# EAGLE design UFBmod_1V0 (EAGLE 7.7.0)
UFBmod - the best digital modulation ever created :-)
Assembly variants: Max, Std

## Sheet 1 of 8: Digilent FPGA
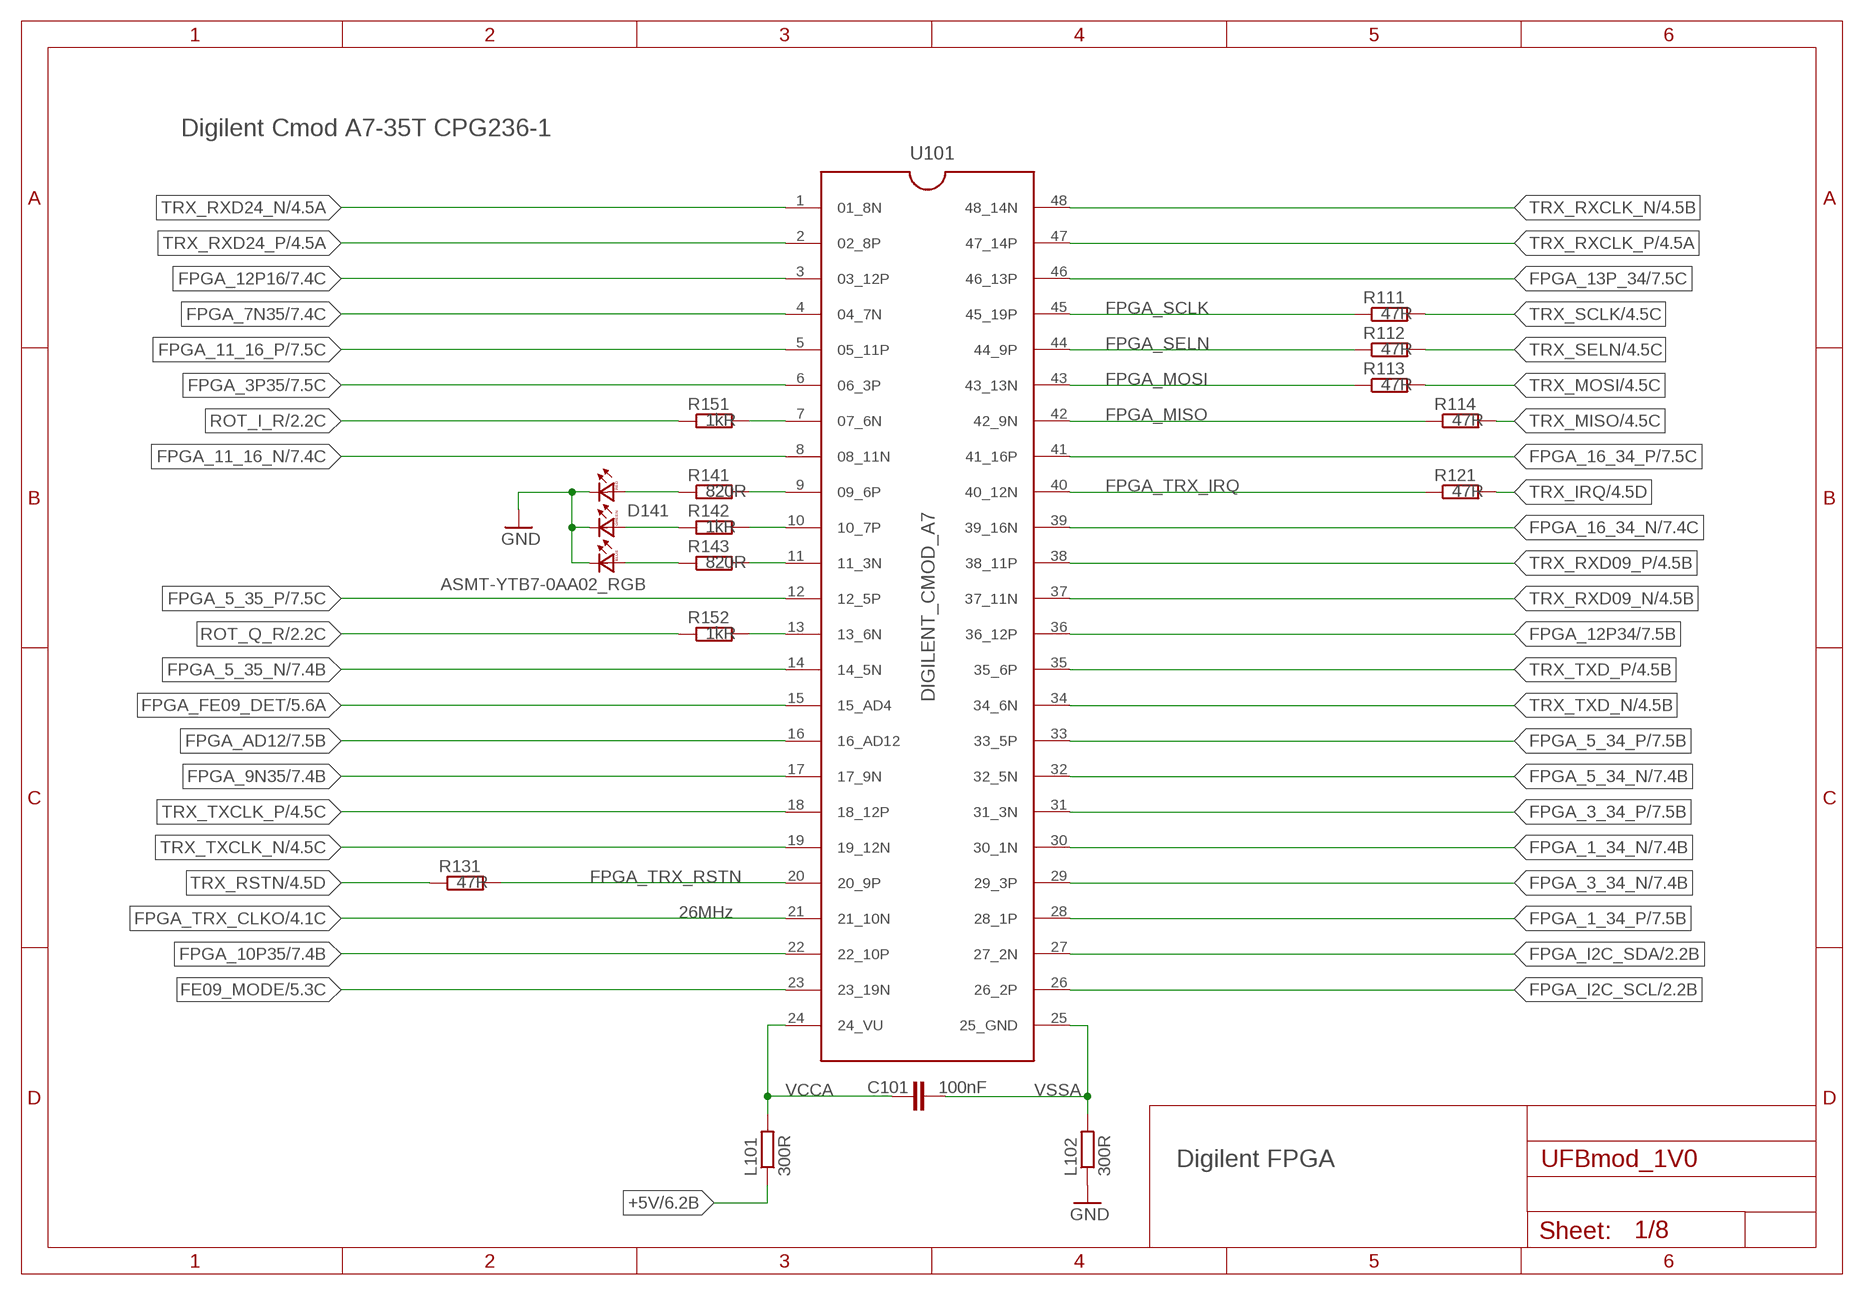
[diagram p0: schematic, sheet 1]

### Parts
C101  100nF  C-EUC0402  [C0402]
D141  ASMT-YTB7-0AA02_RGB  [ASMT-YTB7_0AA02_RGB]
L101  300R  R-EU_R1206  [R1206]
L102  300R  R-EU_R1206  [R1206]
R111  47R  R-EU_R0402  [R0402]
R112  47R  R-EU_R0402  [R0402]
R113  47R  R-EU_R0402  [R0402]
R114  47R  R-EU_R0402  [R0402]
R121  47R  R-EU_R0402  [R0402]
R131  47R  R-EU_R0402  [R0402]
R141  820R  R-EU_R0402  [R0402]
R142  1kR  R-EU_R0402  [R0402]
R143  820R  R-EU_R0402  [R0402]
R151  1kR  R-EU_R0402  [R0402]
R152  1kR  R-EU_R0402  [R0402]
U101  DIGILENT_CMOD_A7  [DIGILENT_CMOD_A7__DIP48]

### Nets
+5V: L101.1 ; also sheet 6,7
FE09_MODE: U101.23(23_19N) ; also sheet 5
FPGA_1_34_N: U101.30(30_1N) ; also sheet 7
FPGA_1_34_P: U101.28(28_1P) ; also sheet 7
FPGA_3_34_N [diff_100R]: U101.29(29_3P) ; also sheet 7
FPGA_3_34_P [diff_100R]: U101.31(31_3N) ; also sheet 7
FPGA_3P35 [diff_100R]: U101.6(06_3P) ; also sheet 7
FPGA_5_34_N [diff_100R]: U101.32(32_5N) ; also sheet 7
FPGA_5_34_P [diff_100R]: U101.33(33_5P) ; also sheet 7
FPGA_5_35_N [diff_100R]: U101.14(14_5N) ; also sheet 7
FPGA_5_35_P [diff_100R]: U101.12(12_5P) ; also sheet 7
FPGA_7N35 [diff_100R]: U101.4(04_7N) ; also sheet 7
FPGA_9N35: U101.17(17_9N) ; also sheet 7
FPGA_10P35: U101.22(22_10P) ; also sheet 7
FPGA_11_16_N [diff_100R]: U101.8(08_11N) ; also sheet 7
FPGA_11_16_P [diff_100R]: U101.5(05_11P) ; also sheet 7
FPGA_12P16 [diff_100R]: U101.3(03_12P) ; also sheet 7
FPGA_12P34: U101.36(36_12P) ; also sheet 7
FPGA_13P_34 [diff_100R]: U101.46(46_13P) ; also sheet 7
FPGA_16_34_N [diff_100R]: U101.39(39_16N) ; also sheet 7
FPGA_16_34_P [diff_100R]: U101.41(41_16P) ; also sheet 7
FPGA_AD12: U101.16(16_AD12) ; also sheet 7
FPGA_FE09_DET: U101.15(15_AD4) ; also sheet 5
FPGA_I2C_SCL: U101.26(26_2P) ; also sheet 2,3
FPGA_I2C_SDA: U101.27(27_2N) ; also sheet 2,3
FPGA_MISO: R114.1 U101.42(42_9N)
FPGA_MOSI: R113.1 U101.43(43_13N)
FPGA_SCLK: R111.1 U101.45(45_19P)
FPGA_SELN: R112.1 U101.44(44_9P)
FPGA_TRX_CLKO: U101.21(21_10N) ; also sheet 4
FPGA_TRX_IRQ: R121.1 U101.40(40_12N)
FPGA_TRX_RSTN: R131.2 U101.20(20_9P)
GND: D141.1(BC) D141.2(GC) D141.3(RC) L102.1 ; also sheet 2,3,4,5,6,7,8
LED_B: D141.6(BA) R143.1
LED_B_R: R143.2 U101.11(11_3N)
LED_G: D141.5(GA) R142.1
LED_G_R: R142.2 U101.10(10_7P)
LED_R: D141.4(RA) R141.1
LED_R_R: R141.2 U101.9(09_6P)
ROT_I: R151.2 U101.7(07_6N)
ROT_I_R: R151.1 ; also sheet 2
ROT_Q: R152.2 U101.13(13_6N)
ROT_Q_R: R152.1 ; also sheet 2
TRX_IRQ: R121.2 ; also sheet 4
TRX_MISO: R114.2 ; also sheet 4
TRX_MOSI: R113.2 ; also sheet 4
TRX_RSTN: R131.1 ; also sheet 4
TRX_RXCLK_N [diff_100R]: U101.48(48_14N) ; also sheet 4
TRX_RXCLK_P [diff_100R]: U101.47(47_14P) ; also sheet 4
TRX_RXD09_N [diff_100R]: U101.37(37_11N) ; also sheet 4
TRX_RXD09_P [diff_100R]: U101.38(38_11P) ; also sheet 4
TRX_RXD24_N [diff_100R]: U101.1(01_8N) ; also sheet 4
TRX_RXD24_P [diff_100R]: U101.2(02_8P) ; also sheet 4
TRX_SCLK: R111.2 ; also sheet 4
TRX_SELN: R112.2 ; also sheet 4
TRX_TXCLK_N [diff_100R]: U101.19(19_12N) ; also sheet 4
TRX_TXCLK_P [diff_100R]: U101.18(18_12P) ; also sheet 4
TRX_TXD_N [diff_100R]: U101.34(34_6N) ; also sheet 4
TRX_TXD_P [diff_100R]: U101.35(35_6P) ; also sheet 4
VCCA: C101.2 L101.2 U101.24(24_VU)
VSSA: C101.1 L102.2 U101.25(25_GND)

### Notes on the sheet
- Digilent Cmod A7-35T CPG236-1
- 26MHz
- Digilent FPGA

## Sheet 2 of 8: I2C - Termination
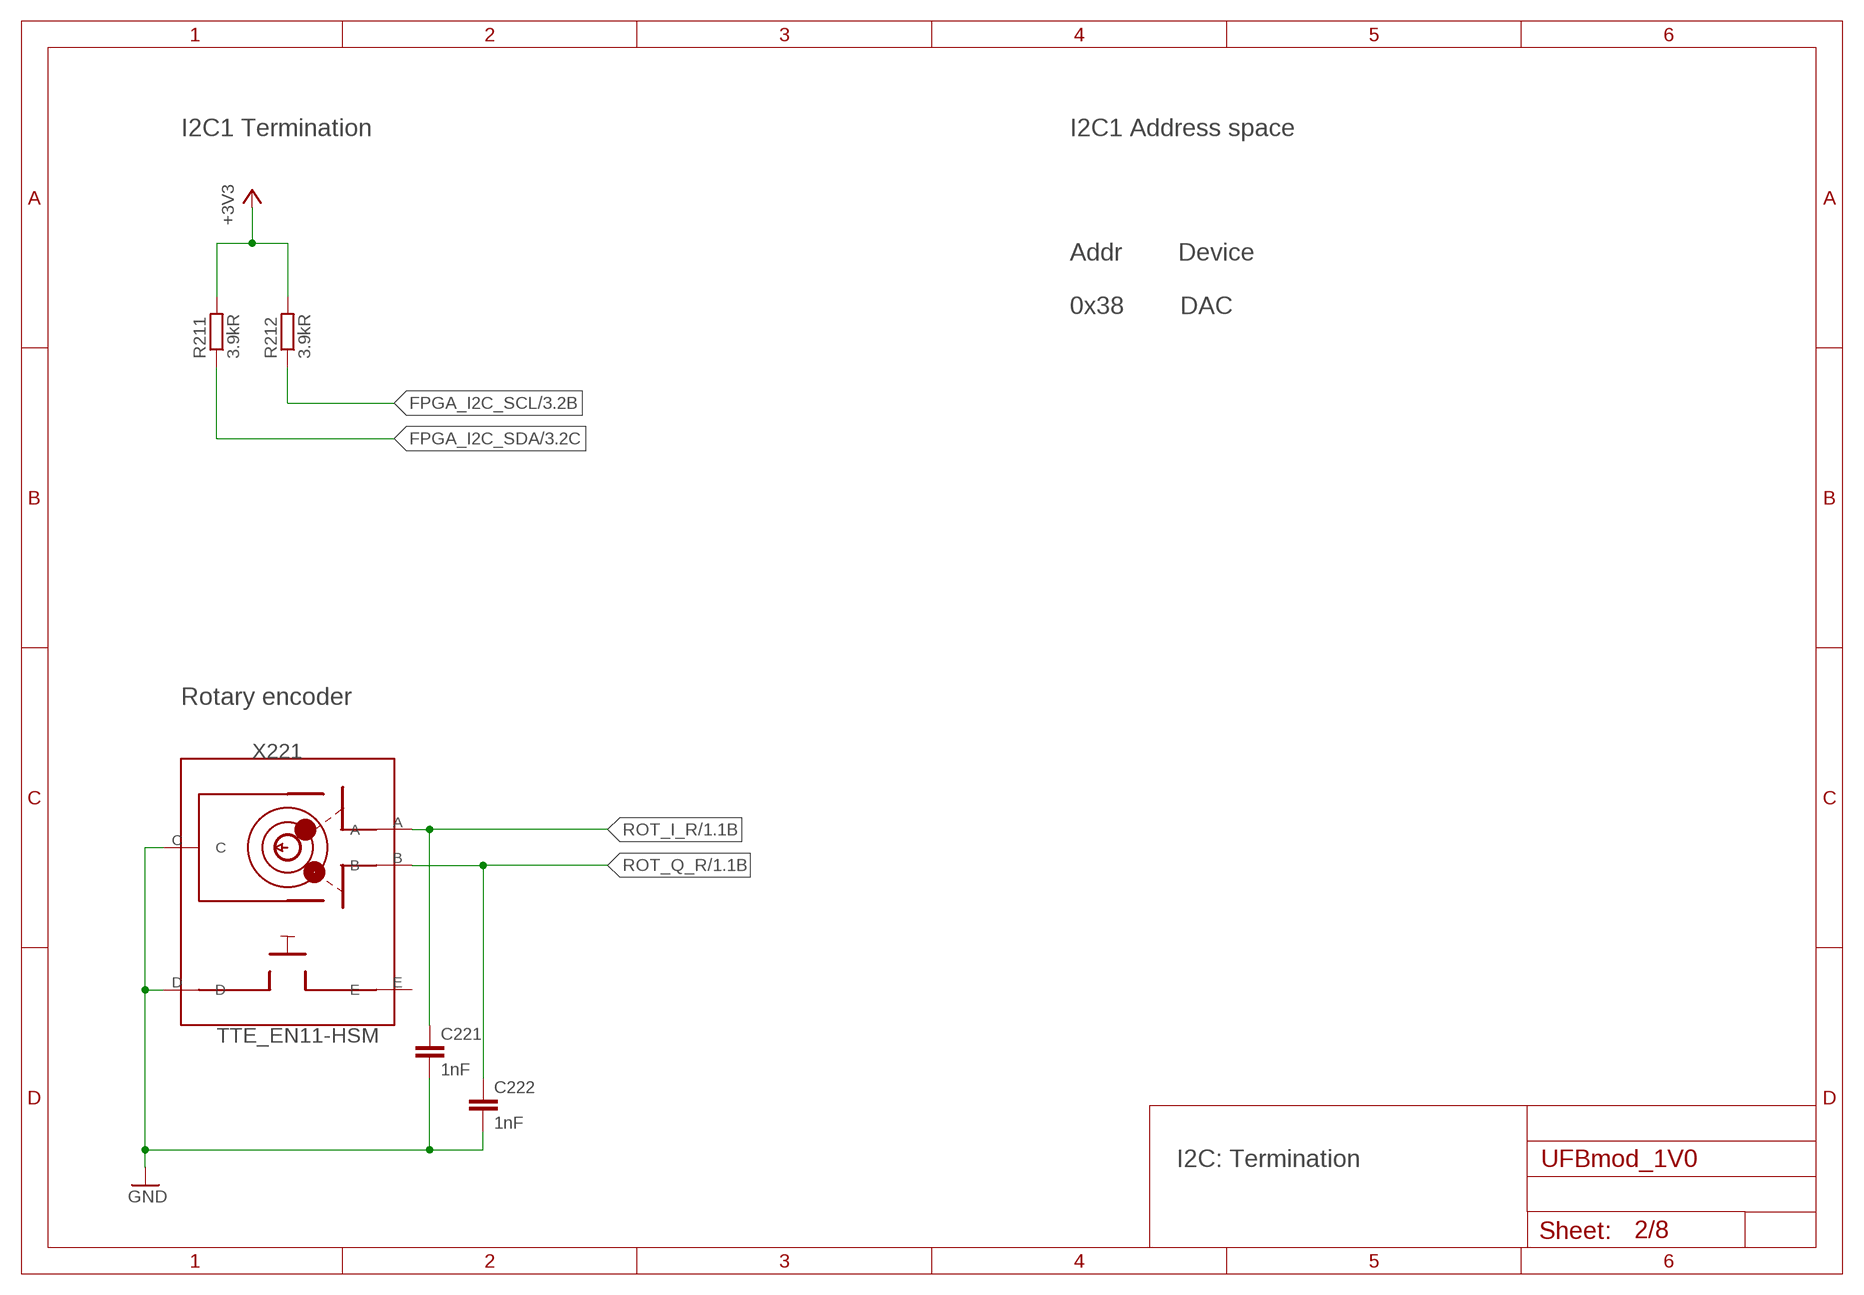
[diagram p1: schematic, sheet 2]

### Parts
C221  1nF  C-EUC0402  [C0402]
C222  1nF  C-EUC0402  [C0402]
R211  3.9kR  R-EU_R0402  [R0402]
R212  3.9kR  R-EU_R0402  [R0402]
X221  TTE_EN11-HSM  [TTE_EN11-HSM]

### Nets
+3V3: R211.2 R212.2 ; also sheet 3,4,5,6,7
FPGA_I2C_SCL: R212.1 ; also sheet 1,3
FPGA_I2C_SDA: R211.1 ; also sheet 1,3
GND: C221.2 C222.2 X221.C X221.D ; also sheet 1,3,4,5,6,7,8
ROT_I_R: C221.1 X221.A ; also sheet 1
ROT_Q_R: C222.1 X221.B ; also sheet 1
Unconnected: X221.E

### Notes on the sheet
- I2C1 Termination | I2C1 Address space
- Addr        Device
  
  0x38        DAC
- Rotary encoder
- I2C: Termination

## Sheet 3 of 8: I2C - DAC
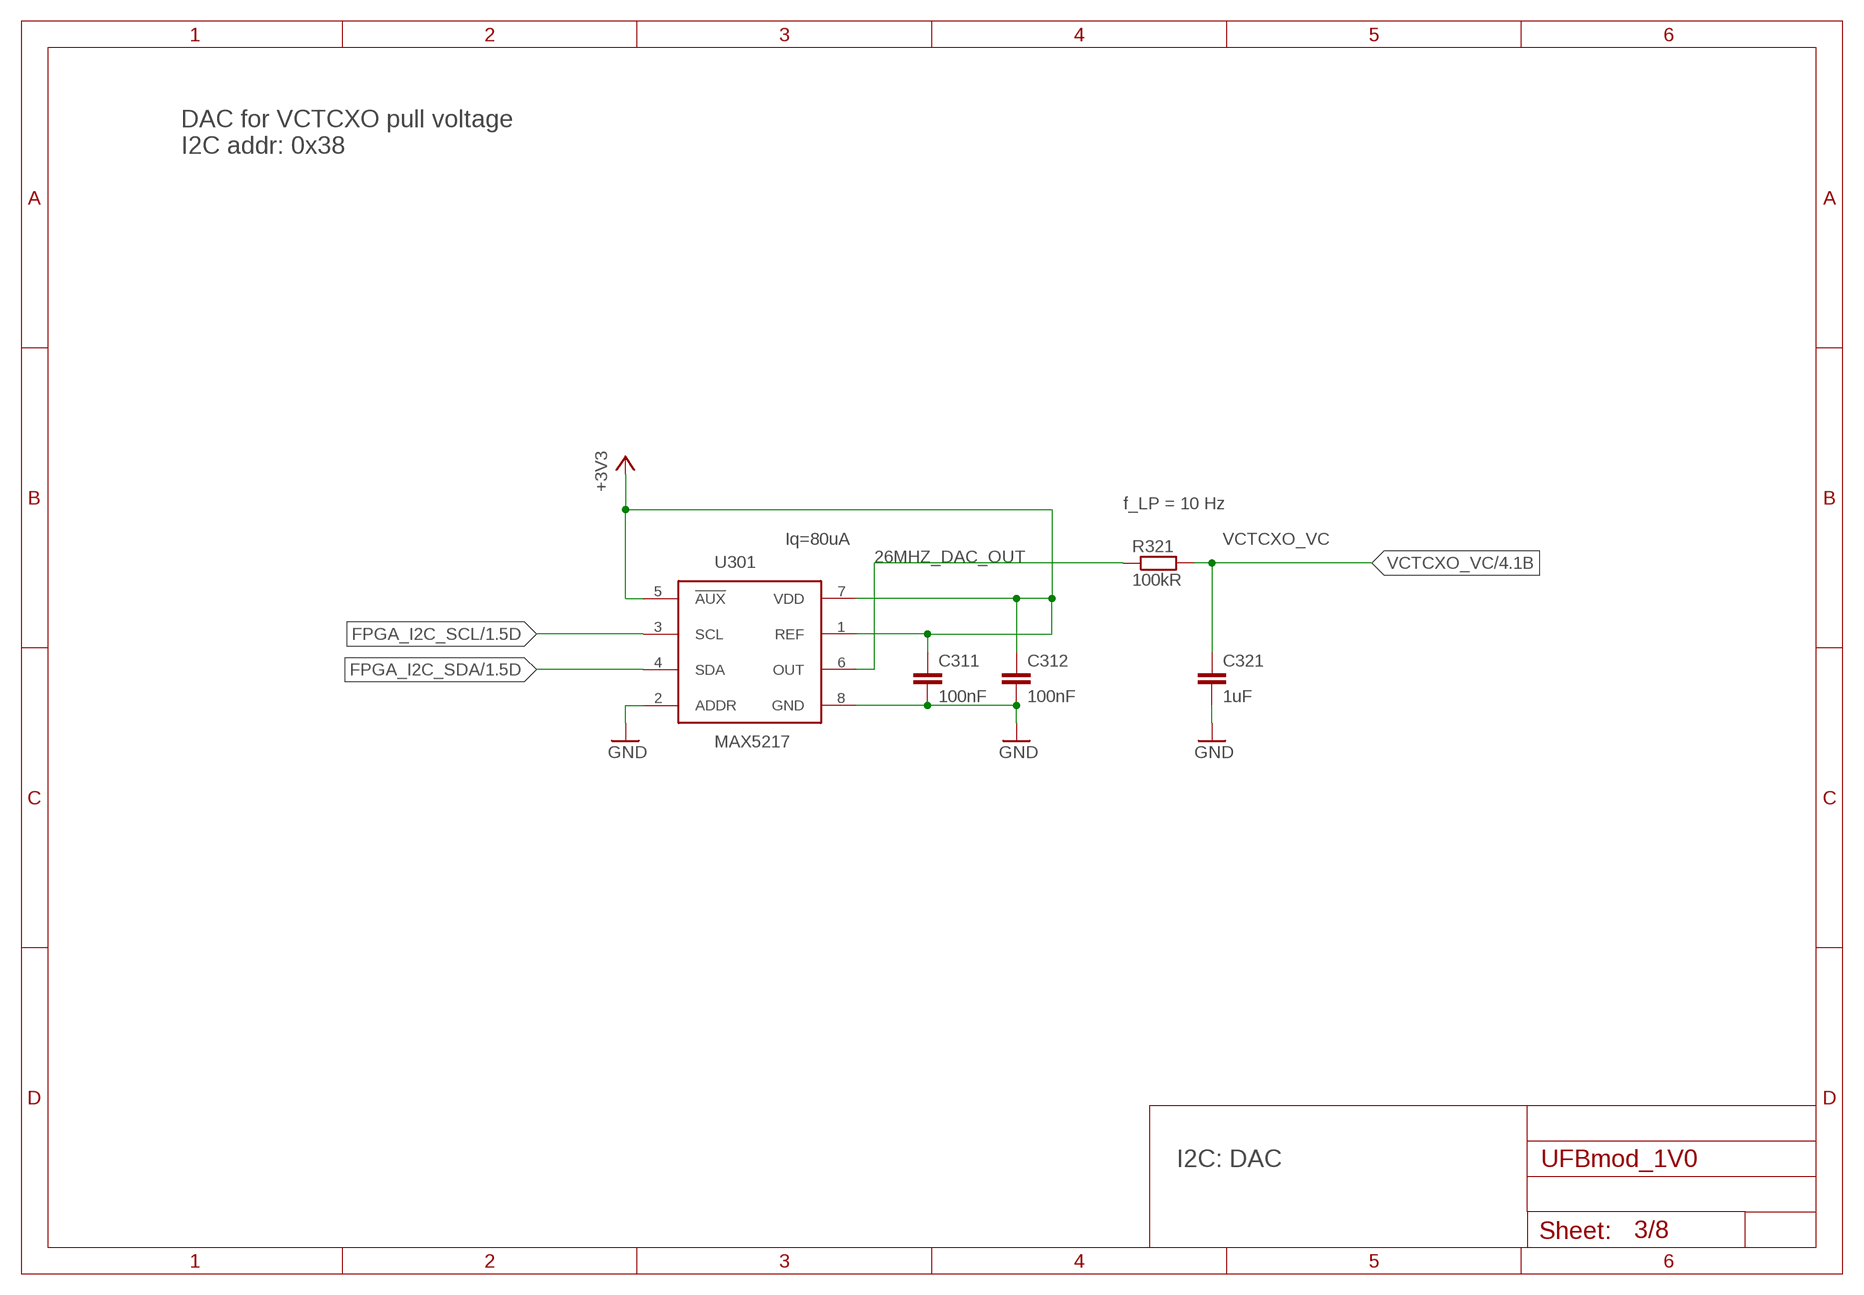
[diagram p2: schematic, sheet 3]

### Parts
C311  100nF  C-EUC0402  [C0402]
C312  100nF  C-EUC0402  [C0402]
C321  1uF  C-EUC0402  [C0402]
R321  100kR  R-EU_R0402  [R0402]
U301  MAX5217  [µMAX8]

### Nets
26MHZ_DAC_OUT: R321.1 U301.6(OUT)
+3V3: C311.1 C312.1 U301.1(REF) U301.5(!AUX) U301.7(VDD) ; also sheet 2,4,5,6,7
FPGA_I2C_SCL: U301.3(SCL) ; also sheet 1,2
FPGA_I2C_SDA: U301.4(SDA) ; also sheet 1,2
GND: C311.2 C312.2 C321.2 U301.2(ADDR) U301.8(GND) ; also sheet 1,2,4,5,6,7,8
VCTCXO_VC: C321.1 R321.2 ; also sheet 4

### Notes on the sheet
- DAC for VCTCXO pull voltage
  I2C addr: 0x38
- f_LP = 10 Hz
- Iq=80uA
- I2C: DAC

## Sheet 4 of 8: SPI - TRX
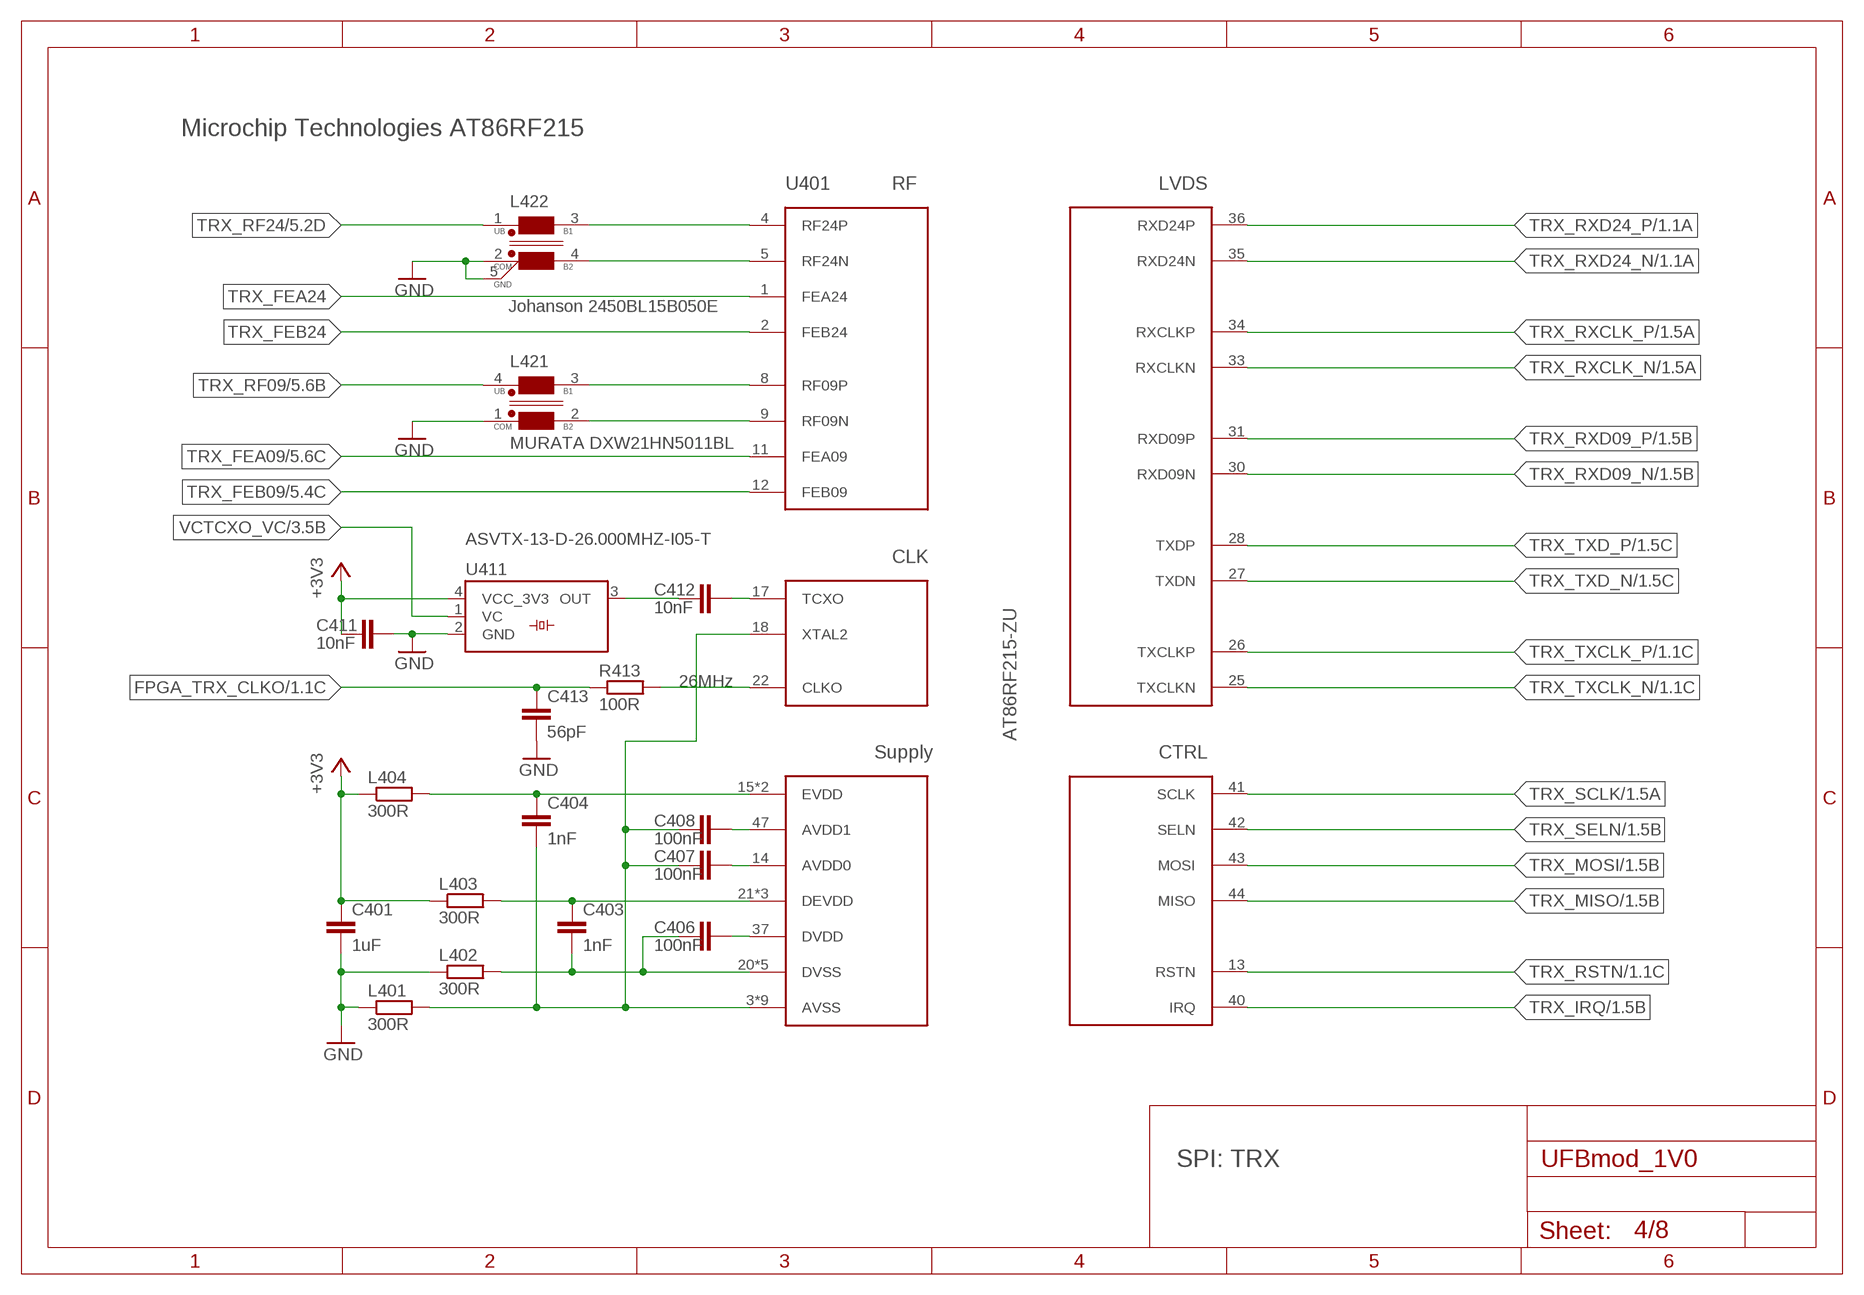
[diagram p3: schematic, sheet 4]

### Parts
C401  1uF  C-EUC0402  [C0402]
C403  1nF  C-EUC0402  [C0402]
C404  1nF  C-EUC0402  [C0402]
C406  100nF  C-EUC0402  [C0402]
C407  100nF  C-EUC0402  [C0402]
C408  100nF  C-EUC0402  [C0402]
C411  10nF  C-EUC0402  [C0402]
C412  10nF  C-EUC0402  [C0402]
C413  56pF  C-EUC0402  [C0402]
L401  300R  R-EU_R1206  [R1206]
L402  300R  R-EU_R1206  [R1206]
L403  300R  R-EU_R1206  [R1206]
L404  300R  R-EU_R1206  [R1206]
L421  MURATA DXW21HN5011BL  DXW21HN5011BL  [DXW21HN5011BL]
L422  Johanson 2450BL15B050E  2450BL15B050  [2450BL15B050]
R413  100R  R-EU_R0402  [R0402]
U401  AT86RF215-ZU  AT86RF215  [QFN48_7X7-0P5-PAD]
U411  ASVTX-13-D-26.000MHZ-I05-T  ASVTX-13-D  [ASVTX-13]

### Nets
+3V3: C401.1 C411.1 L403.1 L404.1 U411.4(VCC_3V3) ; also sheet 2,3,5,6,7
FPGA_TRX_CLKO: C413.1 R413.1 ; also sheet 1
GND: C401.2 C411.2 C413.2 L401.1 L402.1 L421.1(COM) L422.2(COM) L422.5(G_N_D) U411.2(GND) ; also sheet 1,2,3,5,6,7,8
TRX_AVDD0: C407.2 U401.14(AVDD0)
TRX_AVDD1: C408.2 U401.47(AVDD1)
TRX_AVSS: C404.2 C407.1 C408.1 L401.2 U401.3(AVSS) U401.6(AVSS) U401.7(AVSS) U401.10(AVSS) U401.16(AVSS) U401.18(XTAL2) U401.19(AVSS) U401.45(AVSS) U401.48(AVSS) U401.49(AVSS)
TRX_CLKO: R413.2 U401.22(CLKO)
TRX_DEVDD: C403.1 L403.2 U401.21(DEVDD) U401.29(DEVDD) U401.39(DEVDD)
TRX_DVDD: C406.2 U401.37(DVDD)
TRX_DVSS: C403.2 C406.1 L402.2 U401.20(DVSS) U401.23(DVSS) U401.24(DVSS) U401.32(DVSS) U401.38(DVSS)
TRX_EVDD: C404.1 L404.2 U401.15(EVDD) U401.46(EVDD)
TRX_FEA09: U401.11(FEA09) ; also sheet 5
TRX_FEA24: U401.1(FEA24)
TRX_FEB09: U401.12(FEB09) ; also sheet 5
TRX_FEB24: U401.2(FEB24)
TRX_IRQ: U401.40(IRQ) ; also sheet 1
TRX_MISO: U401.44(MISO) ; also sheet 1
TRX_MOSI: U401.43(MOSI) ; also sheet 1
TRX_RF09: L421.4(UB) ; also sheet 5
TRX_RF09_N [diff_100R]: L421.2(B2) U401.9(RF09N)
TRX_RF09_P [diff_100R]: L421.3(B1) U401.8(RF09P)
TRX_RF24: L422.1(UB) ; also sheet 5
TRX_RF24_N: L422.4(B2) U401.5(RF24N)
TRX_RF24_P: L422.3(B1) U401.4(RF24P)
TRX_RSTN: U401.13(RSTN) ; also sheet 1
TRX_RXCLK_N [diff_100R]: U401.33(RXCLKN) ; also sheet 1
TRX_RXCLK_P [diff_100R]: U401.34(RXCLKP) ; also sheet 1
TRX_RXD09_N [diff_100R]: U401.30(RXD09N) ; also sheet 1
TRX_RXD09_P [diff_100R]: U401.31(RXD09P) ; also sheet 1
TRX_RXD24_N [diff_100R]: U401.35(RXD24N) ; also sheet 1
TRX_RXD24_P [diff_100R]: U401.36(RXD24P) ; also sheet 1
TRX_SCLK: U401.41(SCLK) ; also sheet 1
TRX_SELN: U401.42(SELN) ; also sheet 1
TRX_TCXO: C412.2 U401.17(TCXO)
TRX_TXCLK_N [diff_100R]: U401.25(TXCLKN) ; also sheet 1
TRX_TXCLK_P [diff_100R]: U401.26(TXCLKP) ; also sheet 1
TRX_TXD_N [diff_100R]: U401.27(TXDN) ; also sheet 1
TRX_TXD_P [diff_100R]: U401.28(TXDP) ; also sheet 1
VCTCXO_OUT: C412.1 U411.3(OUT)
VCTCXO_VC: U411.1(VC) ; also sheet 3

### Notes on the sheet
- Microchip Technologies AT86RF215
- 26MHz
- SPI: TRX

## Sheet 5 of 8: Front end 868 MHz
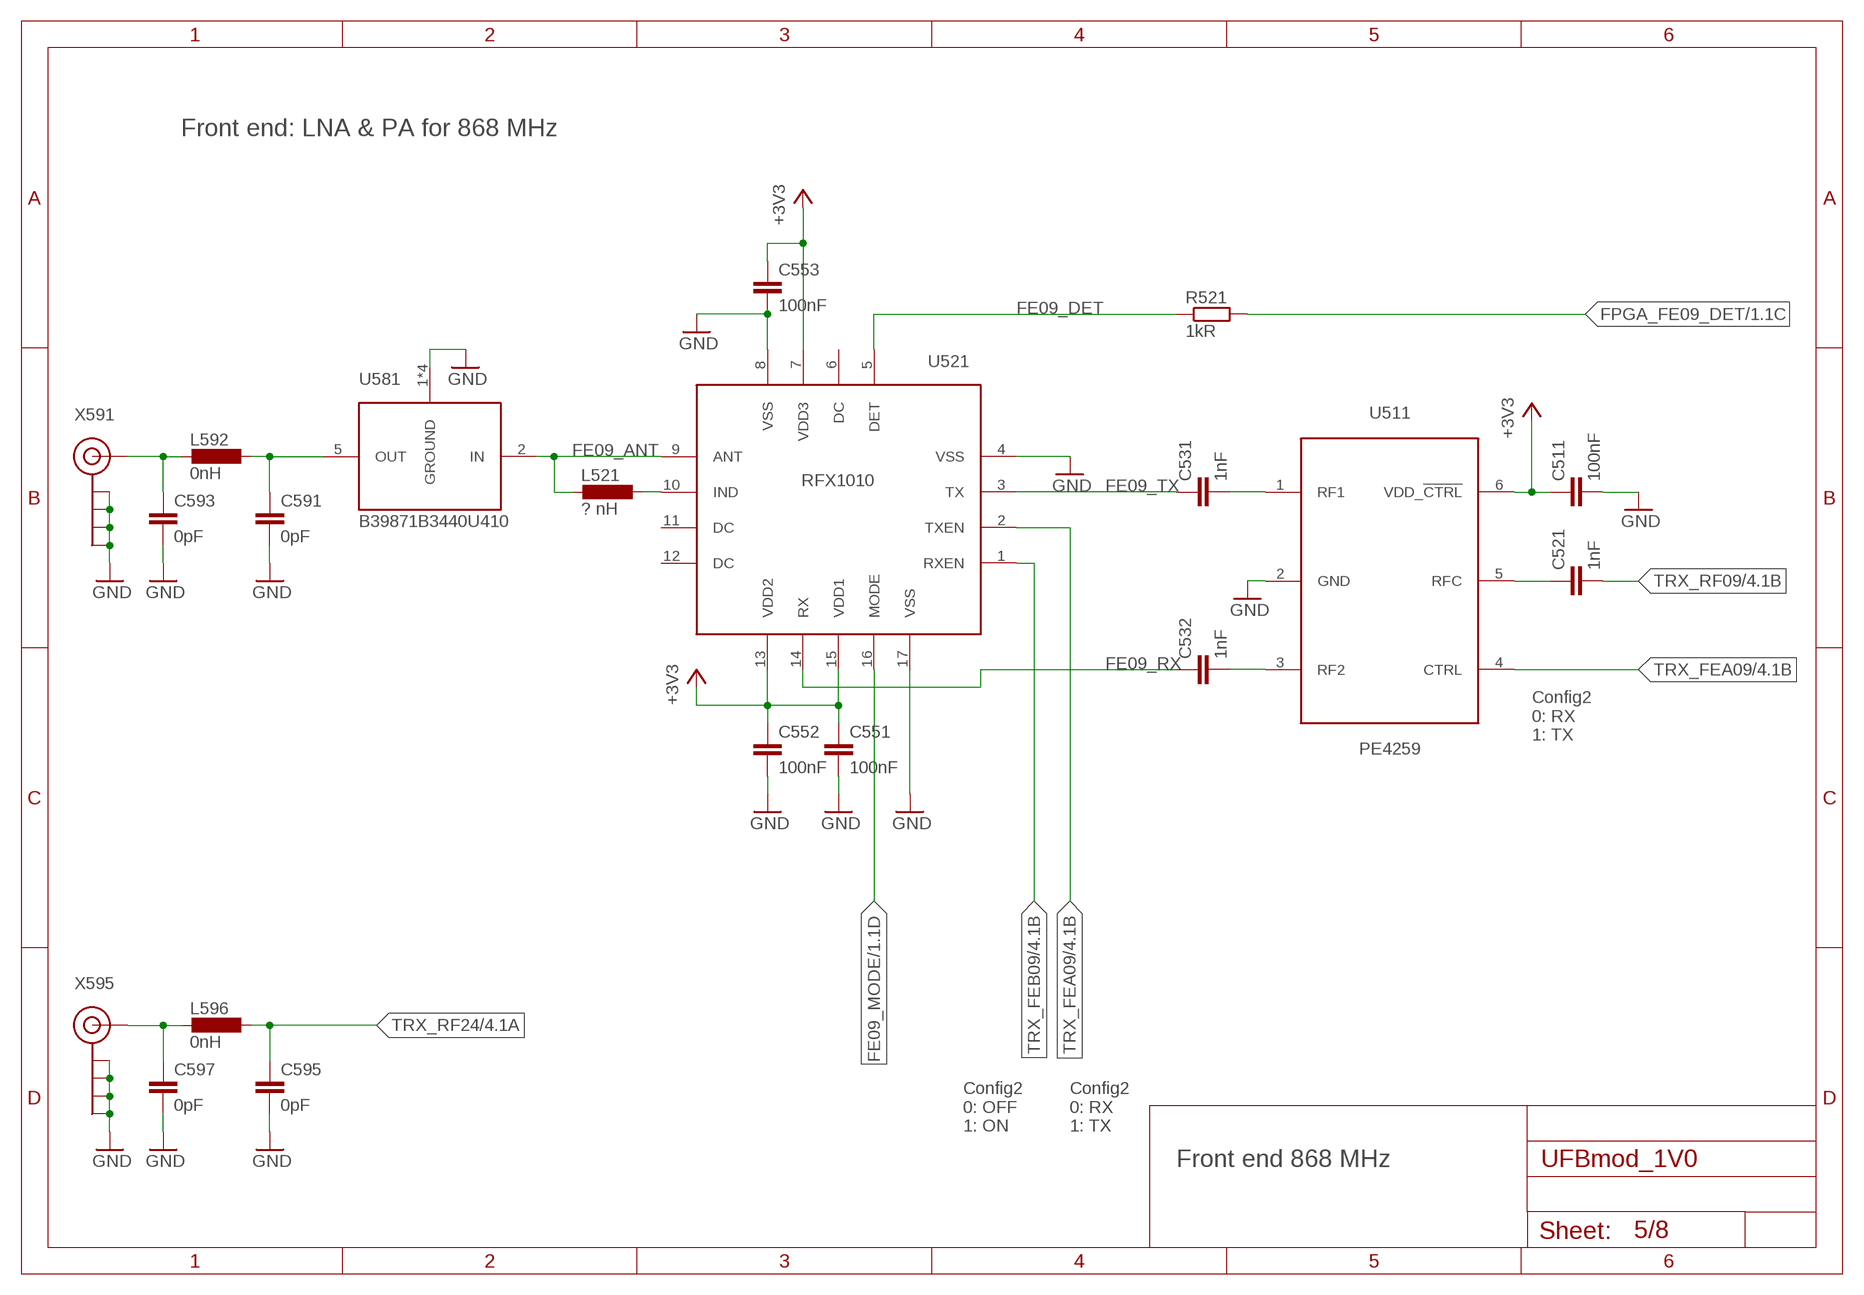
[diagram p4: schematic, sheet 5]

### Parts
C511  100nF  C-EUC0402  [C0402]
C521  1nF  C-EUC0402  [C0402]
C531  1nF  C-EUC0402  [C0402]
C532  1nF  C-EUC0402  [C0402]
C551  100nF  C-EUC0402  [C0402]
C552  100nF  C-EUC0402  [C0402]
C553  100nF  C-EUC0402  [C0402]
C591  0pF  C-EUC0402  [C0402]
C593  0pF  C-EUC0402  [C0402]
C595  0pF  C-EUC0402  [C0402]
C597  0pF  C-EUC0402  [C0402]
L521  ? nH  L-EUL0603  [L0603]
L592  0nH  L-EUL0603  [L0603]
L596  0nH  L-EUL0603  [L0603]
R521  1kR  R-EU_R0402  [R0402]
U511  PE4259  [SC-70_6-LEAD_2X1MM25_0P65]
U521  RFX1010  [QFN16-3X3-0P5-PAD]
U581  B39871B3440U410  B3440  [B3440_3MM-X-3MM]
X591  ANTENNATINY  [SMA_UFL_PAD_TINY]
X595  ANTENNATINY  [SMA_UFL_PAD_TINY]

### Nets
+3V3: C511.1 C551.1 C552.1 C553.1 U511.6(VDD_!CTRL) U521.7(VDD3) U521.13(VDD2) U521.15(VDD1) ; also sheet 2,3,4,6,7
ANT09: C593.1 L592.2 X591.ANT1(SIGNAL) X591.ANT2(SIGNAL) X591.ANT3(SIGNAL)
ANT09_MATCH: C591.1 L592.1 U581.5(OUT)
ANT24: C597.1 L596.2 X595.ANT1(SIGNAL) X595.ANT2(SIGNAL) X595.ANT3(SIGNAL)
FE09_ANT: L521.2 U521.9(ANT) U581.2(IN)
FE09_DET: R521.1 U521.5(DET)
FE09_IND: L521.1 U521.10(IND)
FE09_MODE: U521.16(MODE) ; also sheet 1
FE09_RX: C532.1 U521.14(RX)
FE09_TX: C531.1 U521.3(TX)
FPGA_FE09_DET: R521.2 ; also sheet 1
GND: C511.2 C551.2 C552.2 C553.2 C591.2 C593.2 C595.2 C597.2 U511.2(GND) U521.4(VSS) U521.8(VSS) U521.17(VSS) U581.1(GROUND) U581.3(GROUND) U581.4(GROUND) U581.6(GROUND) X591.GND1(GND) X591.GND2(GND) X591.GND3(GND) X591.GND4(GND) X595.GND1(GND) X595.GND2(GND) X595.GND3(GND) X595.GND4(GND) ; also sheet 1,2,3,4,6,7,8
PE09_RF1: C531.2 U511.1(RF1)
PE09_RF2: C532.2 U511.3(RF2)
PE09_RFC: C521.1 U511.5(RFC)
TRX_FEA09: U511.4(CTRL) U521.2(TXEN) ; also sheet 4
TRX_FEB09: U521.1(RXEN) ; also sheet 4
TRX_RF09: C521.2 ; also sheet 4
TRX_RF24: C595.1 L596.1 ; also sheet 4
Unconnected: U521.6(DC) U521.11(DC) U521.12(DC)

### Notes on the sheet
- Front end: LNA & PA for 868 MHz
- X591
- Config2
  0: RX
  1: TX
- X595
- Config2
  0: OFF
  1: ON
- Config2
  0: RX
  1: TX
- Front end 868 MHz

## Sheet 6 of 8: PMIC 5V --> 3V3
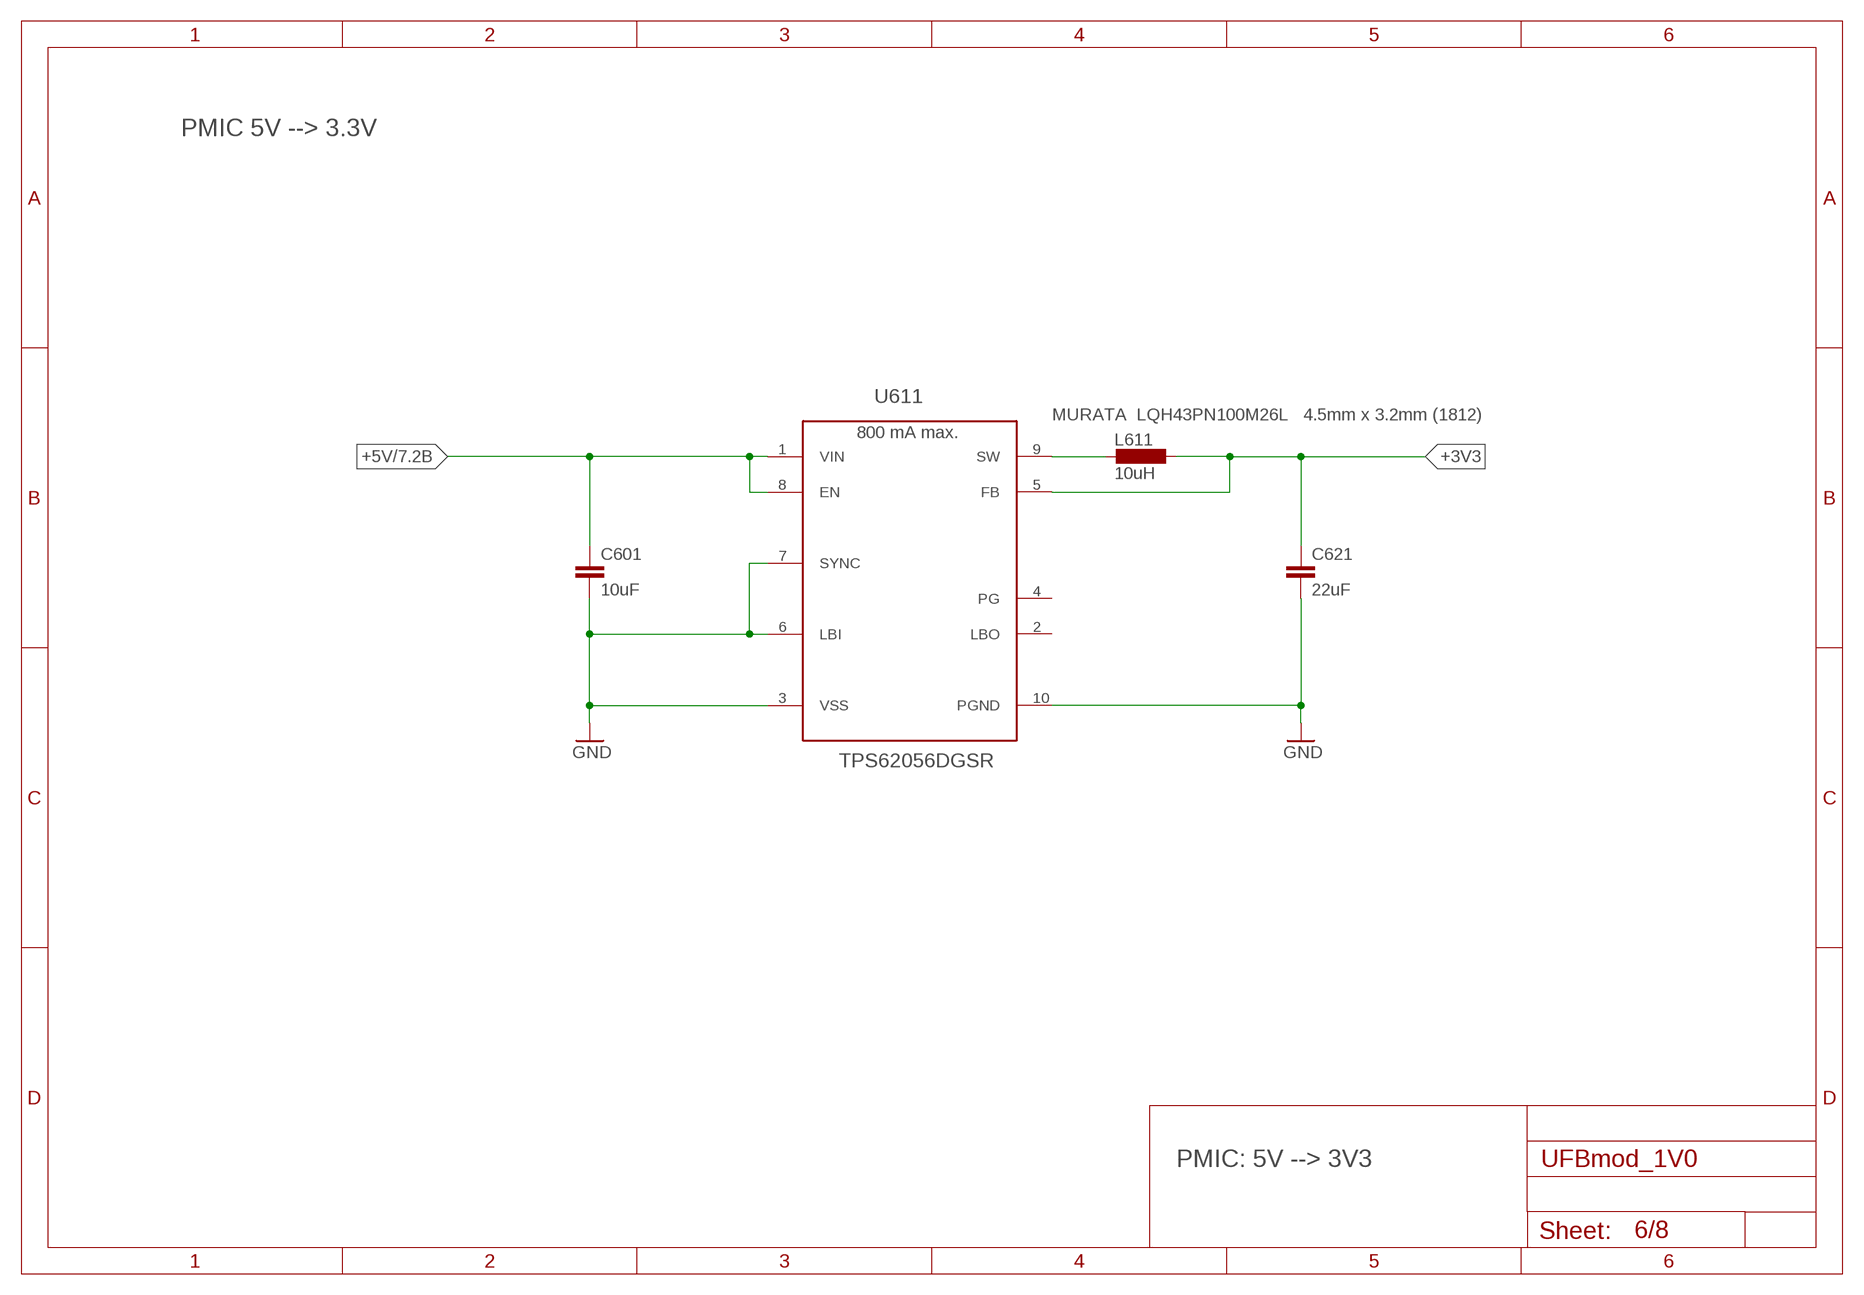
[diagram p5: schematic, sheet 6]

### Parts
C601  10uF  C-EUC0603  [C0603]
C621  22uF  C-EUC0603  [C0603]
L611  10uH  L-EUL1812  [L1812]
U611  TPS62056DGSR  TPS62051  [S-PDSO-G10]

### Nets
+3V3: C621.1 L611.1 U611.5(FB) ; also sheet 2,3,4,5,7
+5V: C601.1 U611.1(VIN) U611.8(EN) ; also sheet 1,7
GND: C601.2 C621.2 U611.3(VSS) U611.6(LBI) U611.7(SYNC) U611.10(PGND) ; also sheet 1,2,3,4,5,7,8
PMIC3V3_SW: L611.2 U611.9(SW)
Unconnected: U611.2(LBO) U611.4(PG)

### Notes on the sheet
- PMIC 5V --> 3.3V
- MURATA  LQH43PN100M26L   4.5mm x 3.2mm (1812)
- 800 mA max.
- PMIC: 5V --> 3V3

## Sheet 7 of 8: Connectors
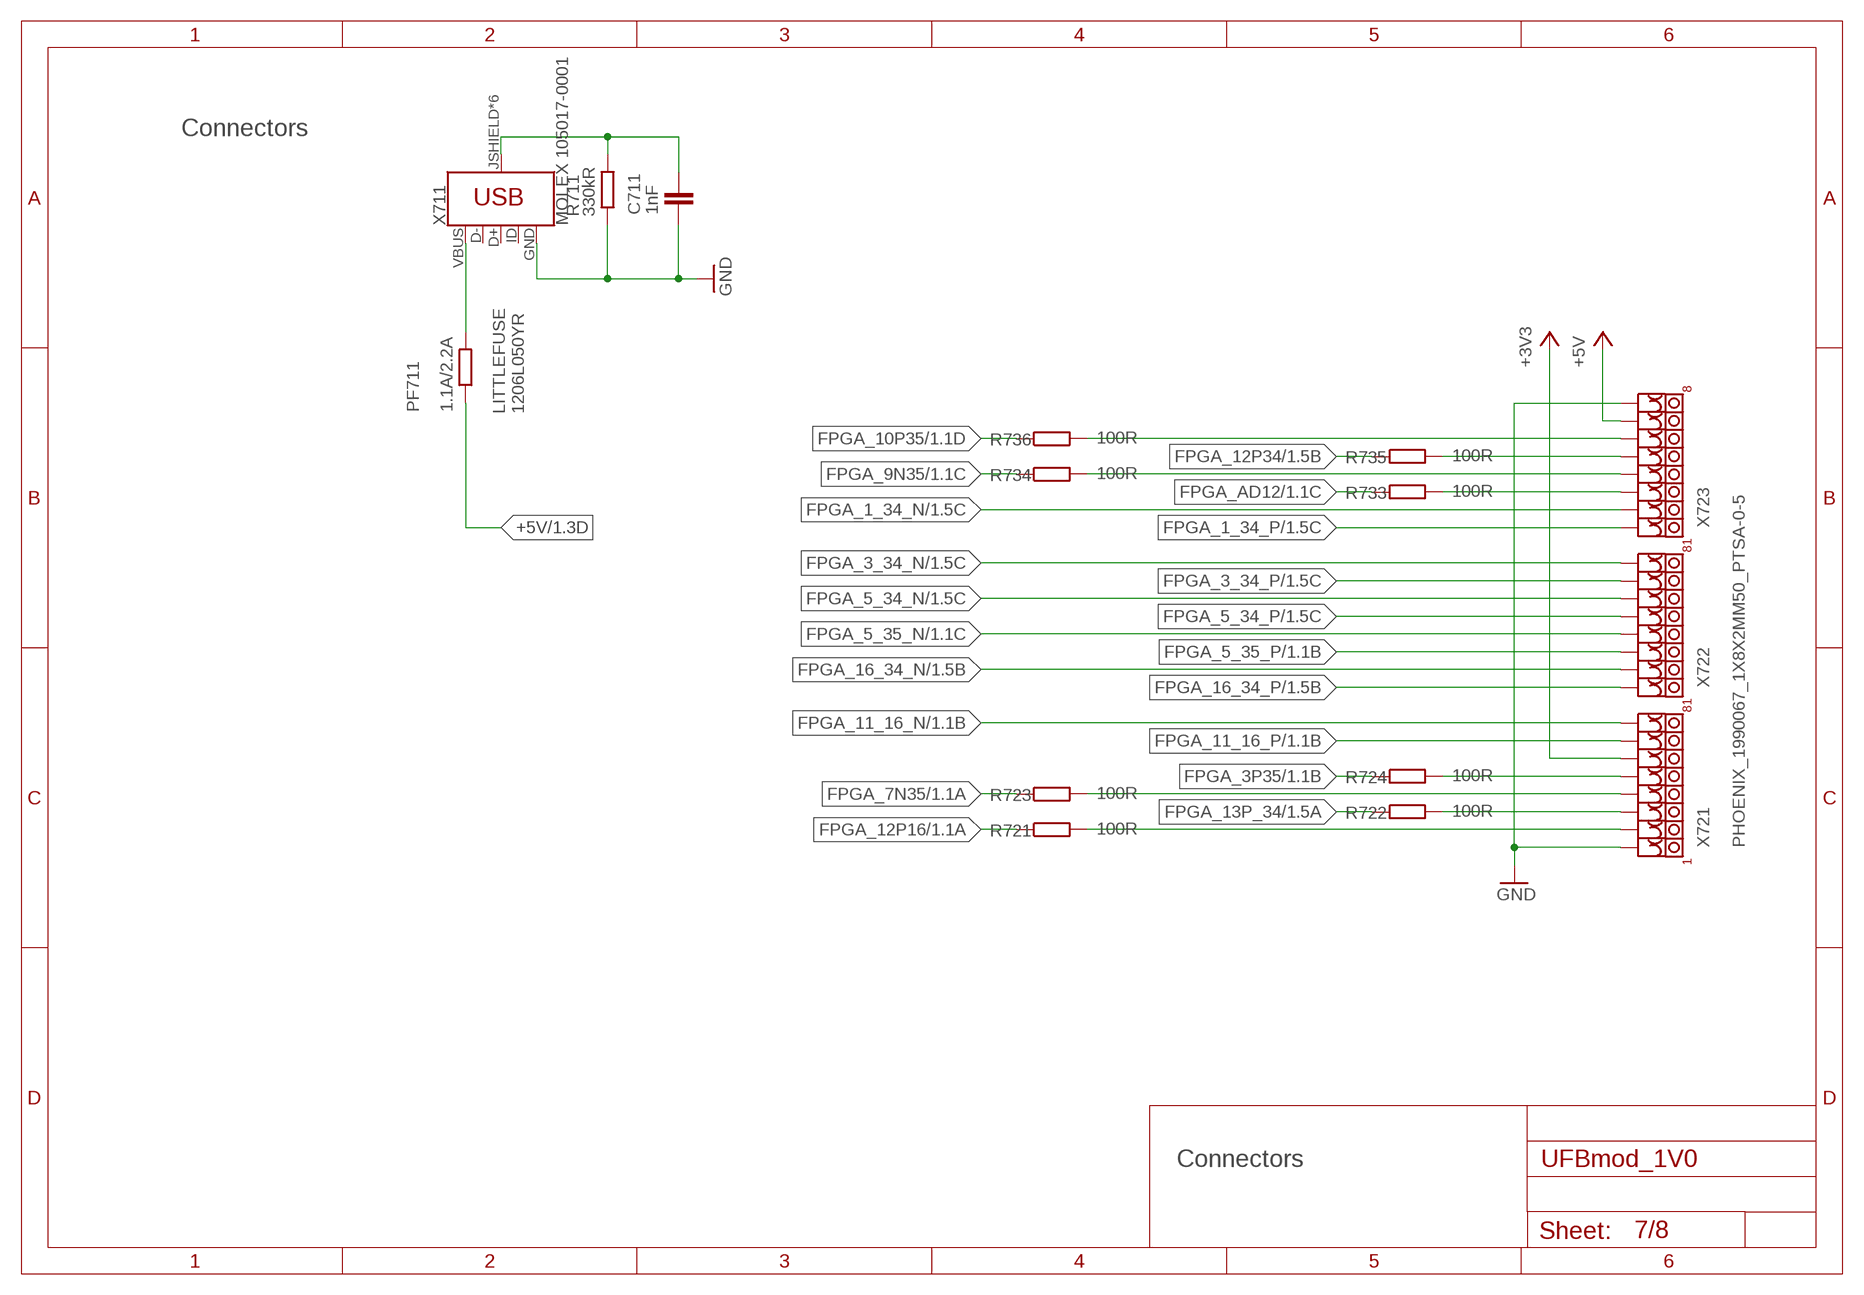
[diagram p6: schematic, sheet 7]

### Parts
C711  1nF  C-EUC0402  [C0402]
PF711  1.1A/2.2A  R-EU_M1206  [M1206]
R711  330kR  R-EU_R0402  [R0402]
R721  100R  R-EU_R0402  [R0402]
R722  100R  R-EU_R0402  [R0402]
R723  100R  R-EU_R0402  [R0402]
R724  100R  R-EU_R0402  [R0402]
R733  100R  R-EU_R0402  [R0402]
R734  100R  R-EU_R0402  [R0402]
R735  100R  R-EU_R0402  [R0402]
R736  100R  R-EU_R0402  [R0402]
X711  MOLEX 105017-0001  USB_MICRO-B_MOLEX  [USB-B-MICRO-SMD_MOLEX-105017-0001]
X721  PHOENIX_1990067_1X8X2MM50_PTSA-0-5  [PHOENIX_1990067_1X8X2MM50_PTSA-0-5]
X722  PHOENIX_1990067_1X8X2MM50_PTSA-0-5  [PHOENIX_1990067_1X8X2MM50_PTSA-0-5]
X723  PHOENIX_1990067_1X8X2MM50_PTSA-0-5  [PHOENIX_1990067_1X8X2MM50_PTSA-0-5]

### Nets
+3V3: X721.6 ; also sheet 2,3,4,5,6
+5V: PF711.1 X723.7 ; also sheet 1,6
FPGA_1_34_N: X723.2 ; also sheet 1
FPGA_1_34_P: X723.1 ; also sheet 1
FPGA_3_34_N [diff_100R]: X722.8 ; also sheet 1
FPGA_3_34_P [diff_100R]: X722.7 ; also sheet 1
FPGA_3P35 [diff_100R]: R724.1 ; also sheet 1
FPGA_3P35_R [diff_100R]: R724.2 X721.5
FPGA_5_34_N [diff_100R]: X722.6 ; also sheet 1
FPGA_5_34_P [diff_100R]: X722.5 ; also sheet 1
FPGA_5_35_N [diff_100R]: X722.4 ; also sheet 1
FPGA_5_35_P [diff_100R]: X722.3 ; also sheet 1
FPGA_7N35 [diff_100R]: R723.1 ; also sheet 1
FPGA_7N35_R [diff_100R]: R723.2 X721.4
FPGA_9N35: R734.1 ; also sheet 1
FPGA_9N35_R: R734.2 X723.4
FPGA_10P35: R736.1 ; also sheet 1
FPGA_10P35_R: R736.2 X723.6
FPGA_11_16_N [diff_100R]: X721.8 ; also sheet 1
FPGA_11_16_P [diff_100R]: X721.7 ; also sheet 1
FPGA_12P16 [diff_100R]: R721.1 ; also sheet 1
FPGA_12P16_R [diff_100R]: R721.2 X721.2
FPGA_12P34: R735.1 ; also sheet 1
FPGA_12P34_R: R735.2 X723.5
FPGA_13P_34 [diff_100R]: R722.1 ; also sheet 1
FPGA_13P_34_R [diff_100R]: R722.2 X721.3
FPGA_16_34_N [diff_100R]: X722.2 ; also sheet 1
FPGA_16_34_P [diff_100R]: X722.1 ; also sheet 1
FPGA_AD12: R733.1 ; also sheet 1
FPGA_AD12_R: R733.2 X723.3
GND: C711.1 R711.1 X711.GND X721.1 X723.8 ; also sheet 1,2,3,4,5,6,8
USB_SHIELD: C711.2 R711.2 X711.JSHIELD(SHIELD) X711.JSHIELD@2(SHIELD) X711.JSHIELD@3(SHIELD) X711.JSHIELD@4(SHIELD) X711.JSHIELD@5(SHIELD) X711.JSHIELD@6(SHIELD)
USB_VBUS: PF711.2 X711.VBUS(J_VUSB)
Unconnected: X711.D+(J_D+) X711.D-(J_D-) X711.ID(J_ID)

### Notes on the sheet
- Connectors
- LITTLEFUSE
  1206L050YR
- Connectors

## Sheet 8 of 8: Mounting holes
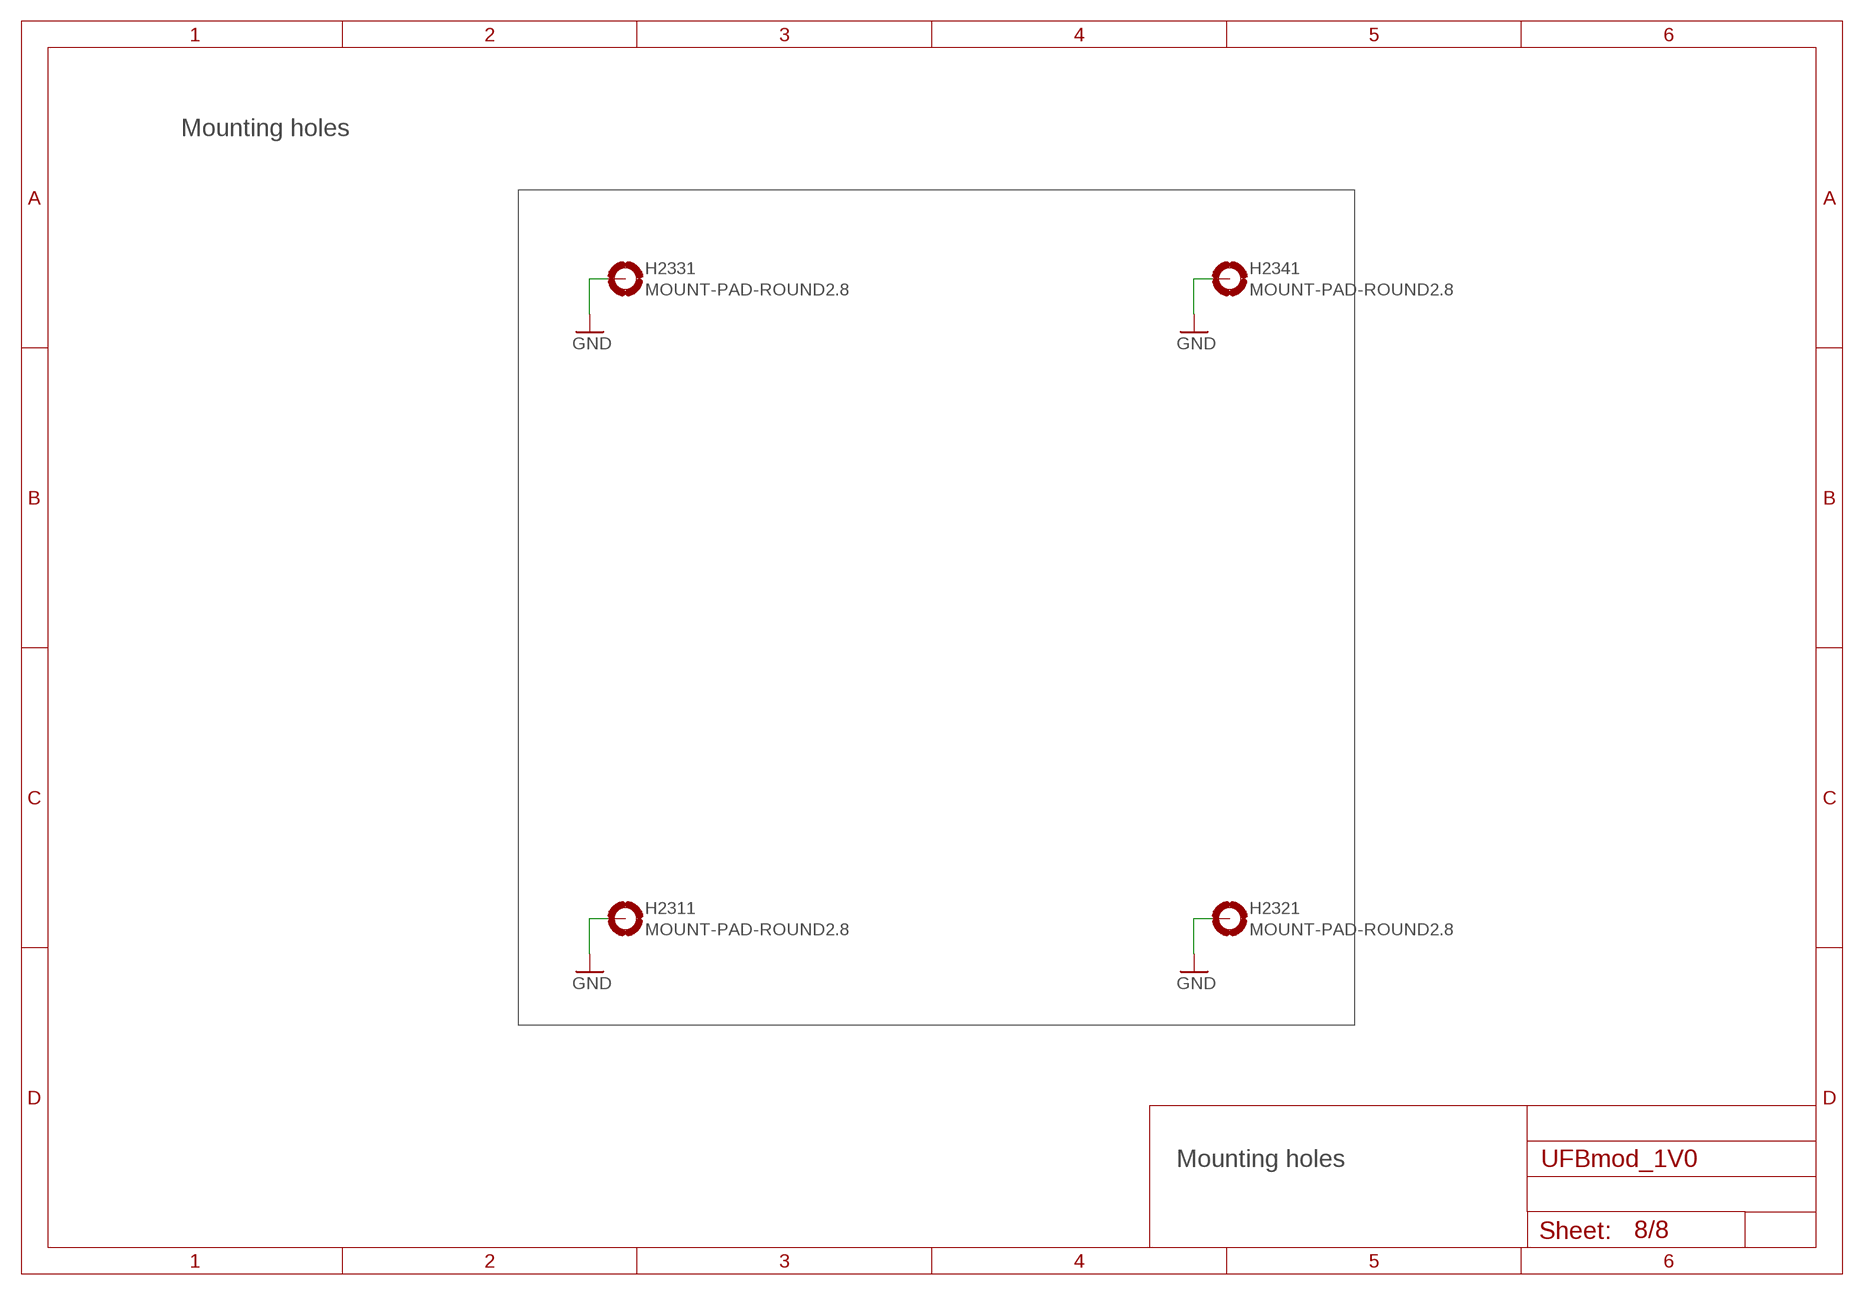
[diagram p7: schematic, sheet 8]

### Parts
H2311  MOUNT-PAD-ROUND2.8  [2,8-PAD]
H2321  MOUNT-PAD-ROUND2.8  [2,8-PAD]
H2331  MOUNT-PAD-ROUND2.8  [2,8-PAD]
H2341  MOUNT-PAD-ROUND2.8  [2,8-PAD]

### Nets
GND: H2311.B2,8(MOUNT) H2321.B2,8(MOUNT) H2331.B2,8(MOUNT) H2341.B2,8(MOUNT) ; also sheet 1,2,3,4,5,6,7

### Notes on the sheet
- Mounting holes
- Mounting holes

## Library data of the parts
C101 C221 C222 C311 C312 C321 C401 C403 C404 C406-C408 C411-C413 C511 C521 C531 C532 C551-C553 C591 C593 C595 C597 C601 C621 C711 = df4iah_rcl:C-EU: CAPACITOR, European symbol
D141 = df4iah_led:ASMT-YTB7-0AA02_RGB: Broadcom ASMT-YTB7-0AA02 Tricolor PLCC6 Black Surface LED
H2311 H2321 H2331 H2341 = df4iah_holes:MOUNT-PAD-ROUND: MOUNTING PAD, round
L101 L102 L401-L404 R111-R114 R121 R131 R141-R143 R151 R152 R211 R212 R321 R413 R521 R711 R721-R724 R733-R736 = df4iah_rcl:R-EU_: RESISTOR, European symbol
L421 = df4iah_balun:DXW21HN5011BL: BALUN DXW21HN5011BL 2x coil transformer 2.00 mm x 1.20 mm
L422 = df4iah_balun:2450BL15B050: BALUN: JOHANSON TECHNOLOGY 2450BL15B050 2.00 mm x 1.25 mm
L521 L592 L596 L611 = df4iah_rcl:L-EU: INDUCTOR, European symbol
PF711 = rcl:R-EU_: RESISTOR, European symbol
U101 = df4iah_fpga:DIGILENT_CMOD_A7: DIGILENT Cmod A7 XILINX Artix 7 board in DIP48 form factor
U301 = df4iah_dac:MAX5217: Maxim Integrated MAX5217 DAC DAC 16 bit, I2C
U401 = df4iah_rf:AT86RF215: Microchip Technology AT86RF215 Sub-1GHz/2.4GHz Transceiver and I/Q Radio for IEEE Std 802.15.4TM-2015 IEEE Std 802.15.4gTM-2012 ETSI TS 102 887-1
U411 = df4iah_osc:ASVTX-13-D: Clock Oscillator ASVTX-13-D 3.3 V variant Voltage control 2.00 mm x 1.60 mm
U511 = df4iah_rf:PE4259: pSemi PE4259 SPDT High Power UltraCMOS® 10 MHz–3.0 GHz RF Switch Low insertion loss: 0.35 dB @ 1000 MHz, 0.5 dB @ 2000 MHz Isolation of 30 dB @ 1000 MHz Typical input 1 dB compression point of +33.5 dBm 6-lead SC-70 package Reference: http://www.psemi.com/products/rf-switches/pe4259
U521 = df4iah_rf:RFX1010: Skyworks RFX1010 Front-End 50 Ohms LNA & PA LNA: 12 dB / 14 dB PA: +27 dBm
U581 = df4iah_rf:B3440: QUALCOMM B3440 SAW-Filter f0 = 869MHz B = 2 MHz 3mm x 3mm
U611 = df4iah_powersupply:TPS62051: TPS62051 800-mA Synchronous Step-Down Converter: 3.3V 12μA Quiescent Current 2.7-V to 10-V Operating Input Voltage Range 100% Maximum Duty Cycle for Lowest Dropout
X221 = df4iah_switch:TTE_EN11-HSM: TT-Electronics EN1-HSM Rotary Encoder with Switch
X591 X595 = _c2h:ANTENNA: SMA Antenna Connector End launch SMA connector. The paste layer has been removed so that the connector can be hand soldered onto the board after reflow.
X711 = df4iah_connector:USB_MICRO-B_MOLEX: USB Type Micro-B Connector Male/female and PTH/SMT variants Molex Products: Micro-USB B Receptacle, Bottom Mount, Surface Mount, with Solder Tabs, Lead-Free <http://www.molex.com/molex/products/datasheet.jsp?part=active/1050170001_IO_CONNECTORS.xml>
X721-X723 = df4iah_connector:PHOENIX_1990067_1X8X2MM50_PTSA-0-5: PCB terminal block - PTSA 0,5/8-2,5-Z - 1990067 PCB terminal block, nominal current: 2 A, nom. voltage: 250 V, pitch: 2.5 mm, number of positions: 8, connection method: Push-in spring connection, mounting: Wave soldering, conductor/PCB connection direction: 45 °

## Net classes
0 default: drill 0.3 mm
1 diff_100R: width 0.3 mm, clearance 0.15 mm
2 pwr_ttl: width 0.75 mm, clearance 0.5 mm
3 usb_pair: width 0.254 mm, clearance 0.152 mm
4 pwrA5: width 0.4 mm
5 single50R: width 0.838 mm, clearance 0.152 mm
6 mil6_nofill: width 0.152 mm, clearance 0.254 mm

## Board
UFBmod - the best digital modulation ever created :-)
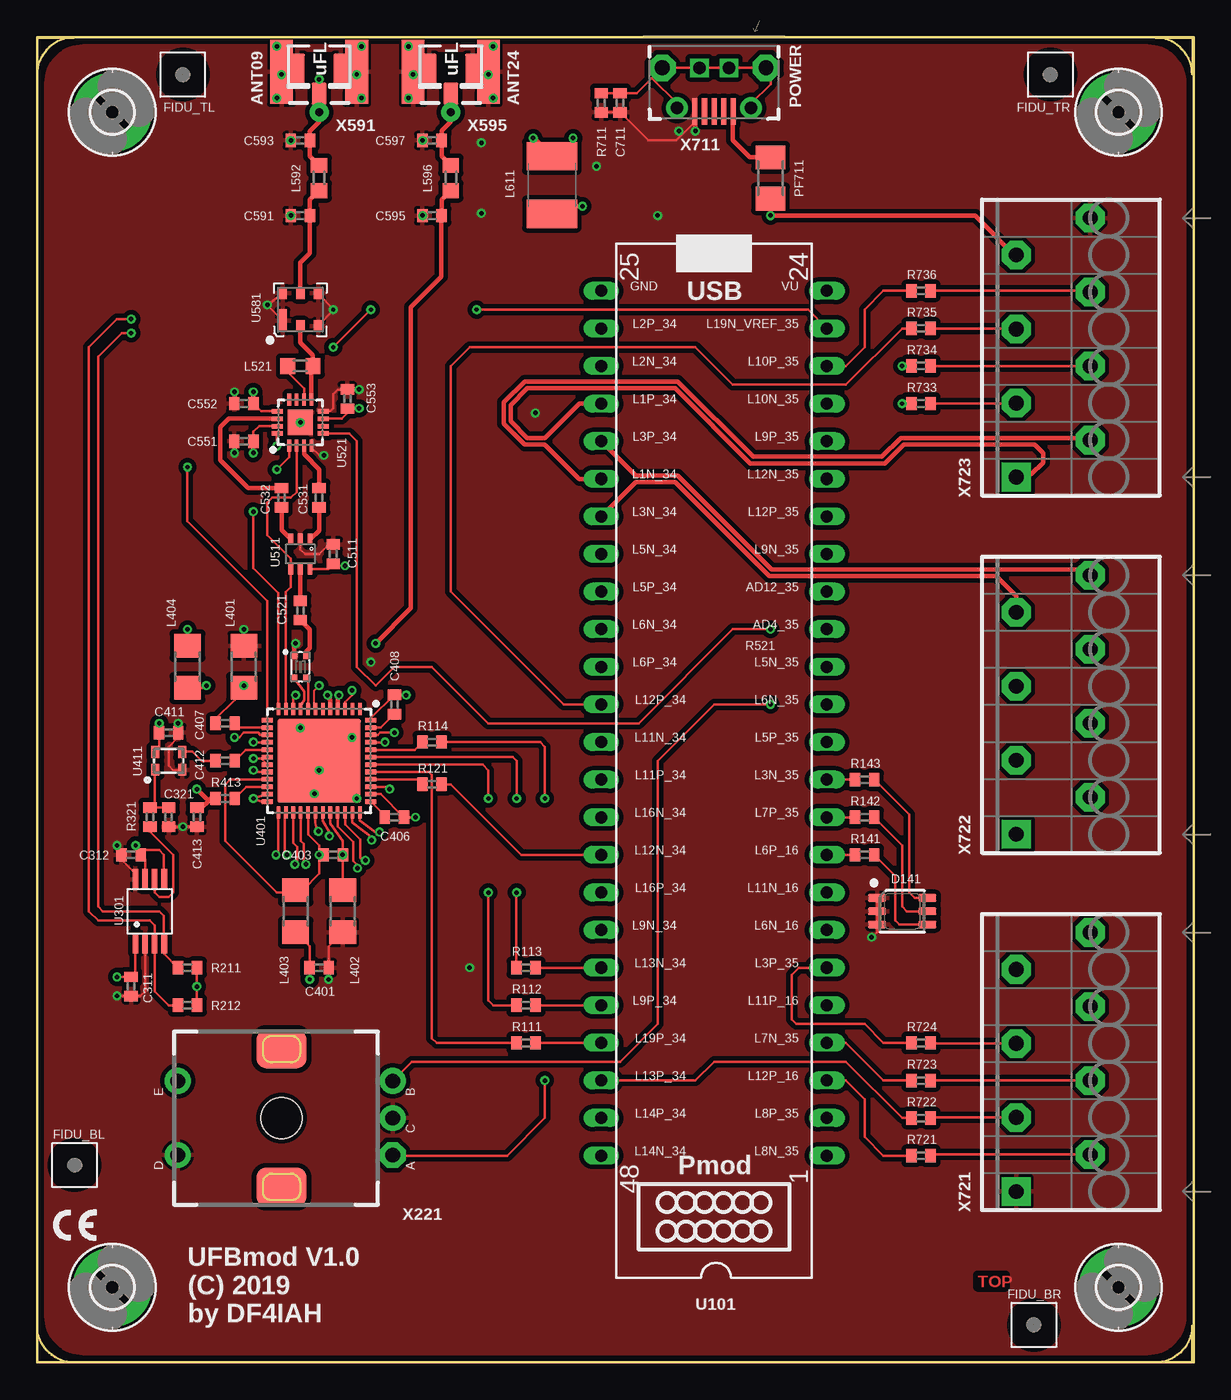
[diagram p8: board, top side]
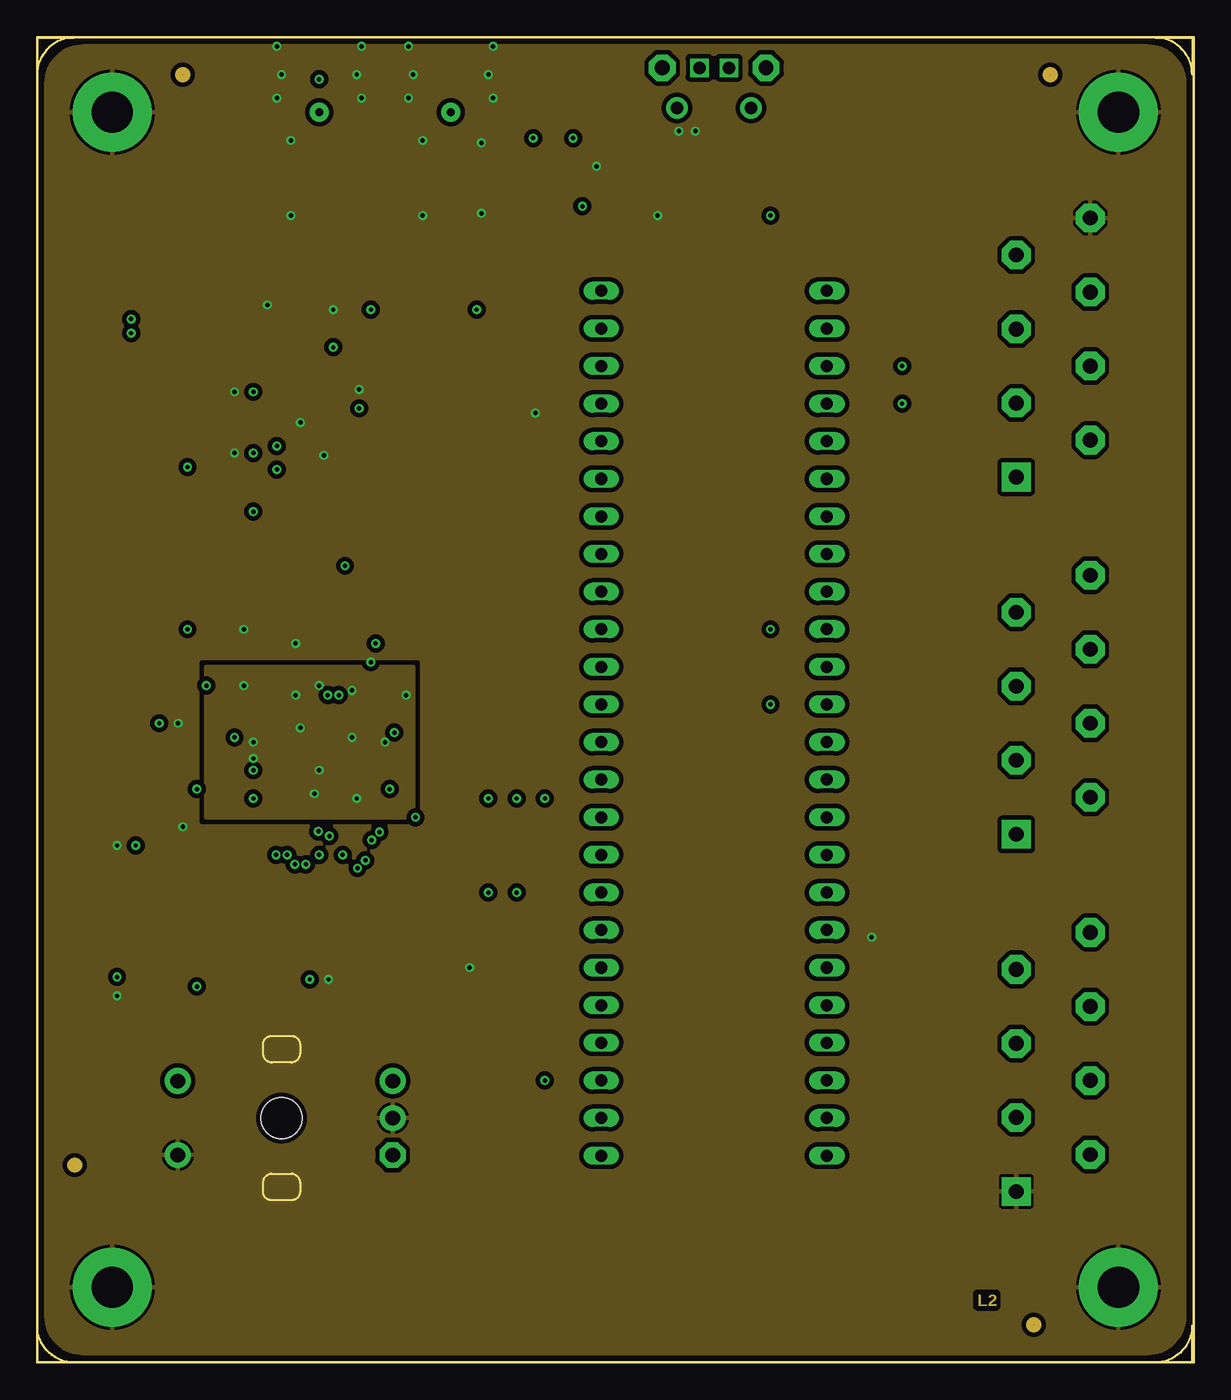
[diagram p9: board, inner layer Route2]
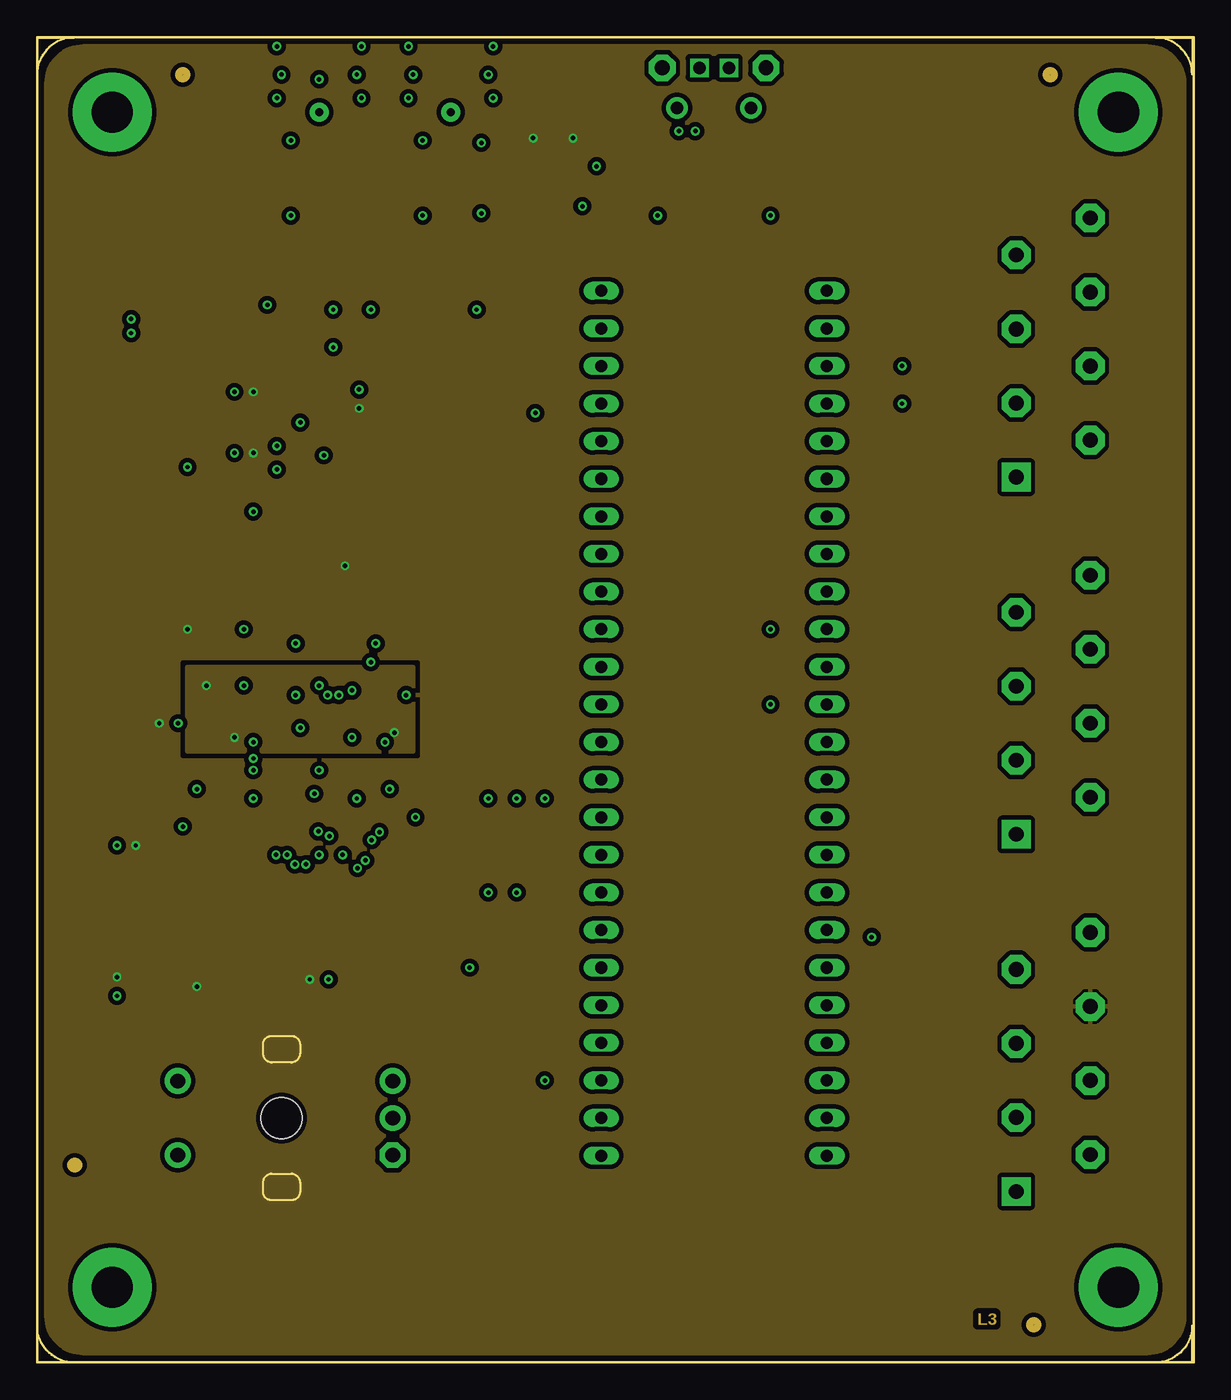
[diagram p10: board, inner layer Route15]
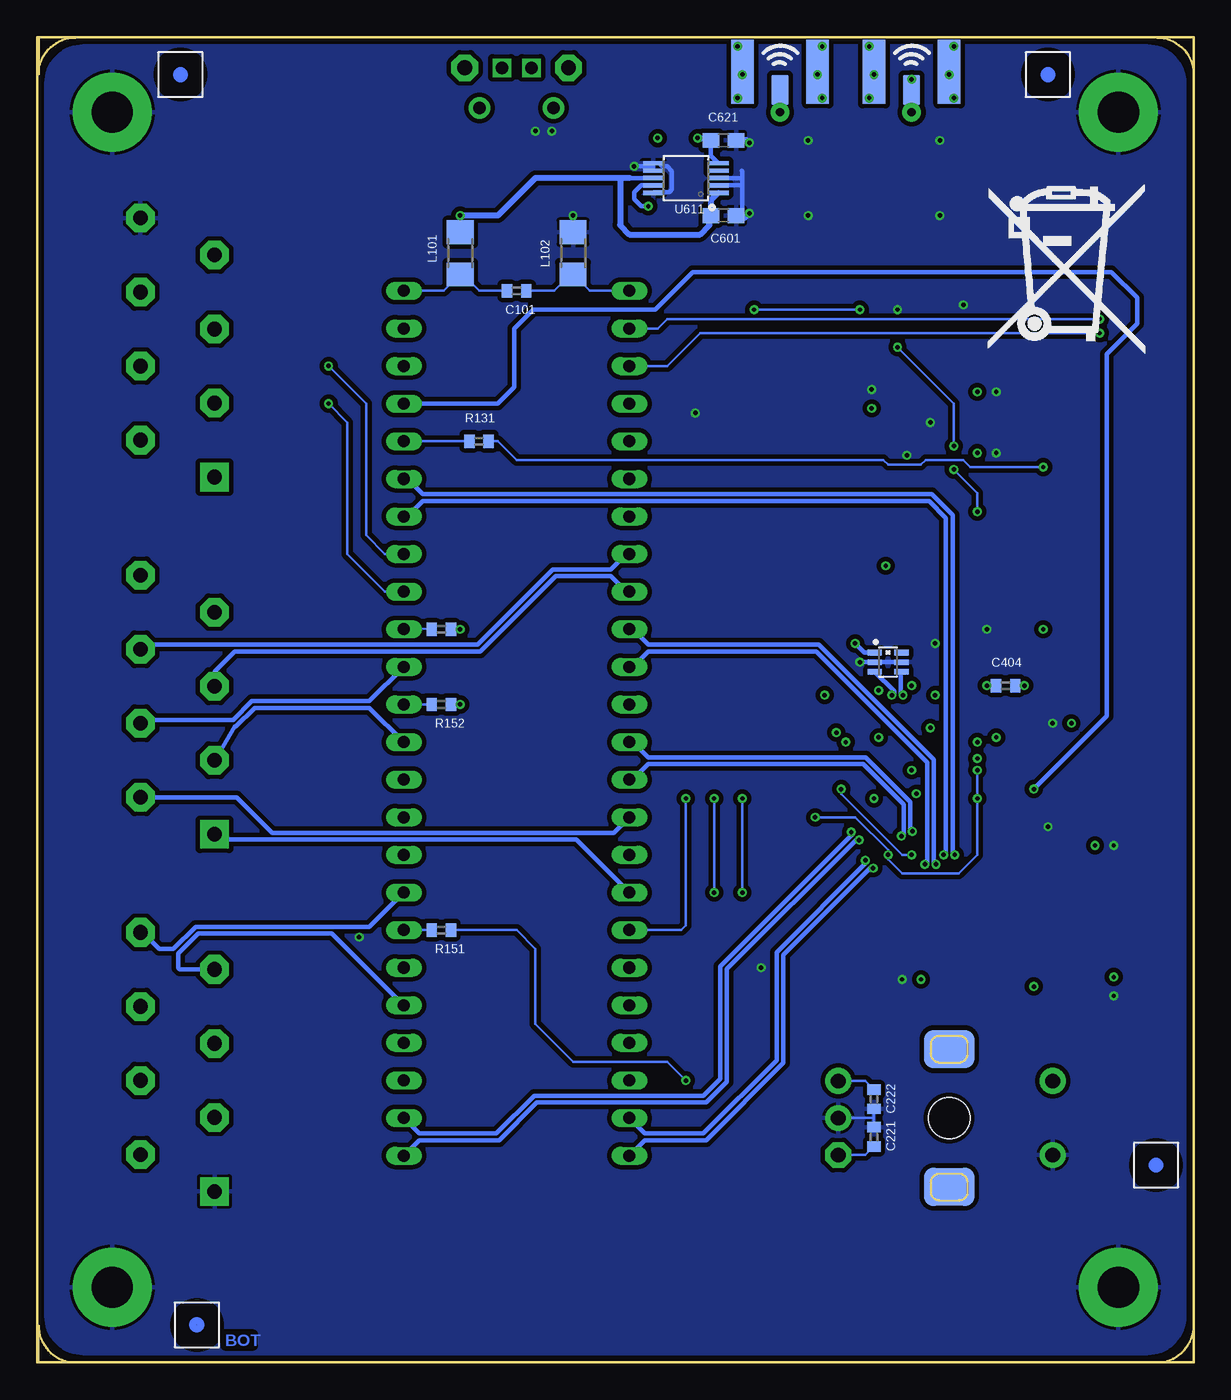
[diagram p11: board, bottom side, seen from below]

Size 78.11 x 89.53 mm. Coordinates in mm from the lower left corner, seen from the top.
Outline: 0,0 0,89.53 78.11,89.53 78.11,0 0,0
Copper layers (1+2*15+16): Top 0.035mm / dielectric 0.38mm / Route2 0.035mm / dielectric 0.71mm / Route15 0.035mm / dielectric 0.38mm / Bottom 0.035mm
Design rules "PCB-POOL Standard_ML4": minimum track width 0.15mm, minimum drill 0.3mm, track to track 0.15mm, track to pad 0.15mm, pad to pad 0.15mm, via to via 0.15mm, smd to smd 0.15mm, copper to edge 0.3mm, drill to drill 0.2mm, minimum pad ring 0.2mm, minimum via ring 0.15mm, stop-mask expansion 0.075mm, vias tented up to drill 0mil, thermal gap 0.2mm
tRestrict: area 88.3,43.2 to 91.7,43.4; area 88.3,41.7 to 91.8,41.9; area 84.3,15.9 to 91.9,32.3
bRestrict: area 84.5,15.9 to 91.4,32.4; area 88.3,43.2 to 91.8,43.5; area 88.3,41.6 to 91.7,41.9; area 84.3,15.9 to 91.9,32.3
Milling: area 0,87 to 2.5,89.5; area 0,0 to 2.5,2.5; area 75.5,0 to 78,2.5; area 75.5,87 to 78,89.5

### Footprints (pad centres in the part's own frame; a part is rotated, then mirrored left to right if it is on the bottom)
C0402 = smd 0.7 x 0.9: 1 -0.65,0; 2 0.65,0
C0603 = smd 1.1 x 1: 1 -0.85,0; 2 0.85,0
ASMT-YTB7_0AA02_RGB = smd 1.2 x 0.5: 1 -1.7,0.9; 2 -1.7,0; 3 -1.7,-0.9; 4 1.7,-0.9; 5 1.7,0; 6 1.7,0.9
2,8-PAD = drill 2.8 pad 5.334: B2,8 0,0
R1206 = smd 1.6 x 1.803: 1 -1.422,0; 2 1.422,0
DXW21HN5011BL = smd 0.5 x 0.45: 1 -0.775,-0.4; 2 0.775,-0.4; 3 0.775,0.4; 4 -0.775,0.4
2450BL15B050 = smd 0.35 x 1: 1 -0.65,-0.9; 2 0,-0.9; 3 0.65,-0.9; 4 0.65,0.9; 5 0,0.9; 6 -0.65,0.9
L0603 = smd 1 x 1.1: 1 -0.85,0; 2 0.85,0
L1812 = smd 1.9 x 3.4: 1 -1.95,0; 2 1.95,0
M1206 = smd 1.6 x 2: 1 -1.4,0; 2 1.4,0
R0402 = smd 0.7 x 0.9: 1 -0.65,0; 2 0.65,0
DIGILENT_CMOD_A7__DIP48 = drill 0.813 long: 1 -29.21,-7.62; 2 -26.67,-7.62; 3 -24.13,-7.62; 4 -21.59,-7.62; 5 -19.05,-7.62; 6 -16.51,-7.62; 7 -13.97,-7.62; 8 -11.43,-7.62; 9 -8.89,-7.62; 10 -6.35,-7.62; 11 -3.81,-7.62; 12 -1.27,-7.62; 13 1.27,-7.62; 14 3.81,-7.62; 15 6.35,-7.62; 16 8.89,-7.62; 17 11.43,-7.62; 18 13.97,-7.62; 19 16.51,-7.62; 20 19.05,-7.62; 21 21.59,-7.62; 22 24.13,-7.62; 23 26.67,-7.62; 24 29.21,-7.62; 25 29.21,7.62; 26 26.67,7.62; 27 24.13,7.62; 28 21.59,7.62; 29 19.05,7.62; 30 16.51,7.62; 31 13.97,7.62; 32 11.43,7.62; 33 8.89,7.62; 34 6.35,7.62; 35 3.81,7.62; 36 1.27,7.62; 37 -1.27,7.62; 38 -3.81,7.62; 39 -6.35,7.62; 40 -8.89,7.62; 41 -11.43,7.62; 42 -13.97,7.62; 43 -16.51,7.62; 44 -19.05,7.62; 45 -21.59,7.62; 46 -24.13,7.62; 47 -26.67,7.62; 48 -29.21,7.62
µMAX8 = smd 1.35 x 0.4: 1 -2.15,0.975; 2 -2.15,0.325; 3 -2.15,-0.325; 4 -2.15,-0.975; 5 2.15,-0.975; 6 2.15,-0.325; 7 2.15,0.325; 8 2.15,0.975
QFN48_7X7-0P5-PAD = smd 0.8 x 0.3: 1 -3.5,2.75; 2 -3.5,2.25; 3 -3.5,1.75; 4 -3.5,1.25; 5 -3.5,0.75; 6 -3.5,0.25; 7 -3.5,-0.25; 8 -3.5,-0.75; 9 -3.5,-1.25; 10 -3.5,-1.75; 11 -3.5,-2.25; 12 -3.5,-2.75; 25 3.5,-2.75; 26 3.5,-2.25; 27 3.5,-1.75; 28 3.5,-1.25; 29 3.5,-0.75; 30 3.5,-0.25; 31 3.5,0.25; 32 3.5,0.75; 33 3.5,1.25; 34 3.5,1.75; 35 3.5,2.25; 36 3.5,2.75 | smd 0.3 x 0.8: 13 -2.75,-3.5; 14 -2.25,-3.5; 15 -1.75,-3.5; 16 -1.25,-3.5; 17 -0.75,-3.5; 18 -0.25,-3.5; 19 0.25,-3.5; 20 0.75,-3.5; 21 1.25,-3.5; 22 1.75,-3.5; 23 2.25,-3.5; 24 2.75,-3.5; 37 2.75,3.5; 38 2.25,3.5; 39 1.75,3.5; 40 1.25,3.5; 41 0.75,3.5; 42 0.25,3.5; 43 -0.25,3.5; 44 -0.75,3.5; 45 -1.25,3.5; 46 -1.75,3.5; 47 -2.25,3.5; 48 -2.75,3.5 | smd 5.65 x 5.65: 49 0,0
ASVTX-13 = smd 0.6 x 0.8: 1 -0.9,-0.6; 2 0.9,-0.6; 3 0.9,0.6; 4 -0.9,0.6
SC-70_6-LEAD_2X1MM25_0P65 = smd 0.4 x 0.8: 1 -0.65,-1; 2 0,-1; 3 0.65,-1; 4 0.65,1; 5 0,1; 6 -0.65,1
QFN16-3X3-0P5-PAD = smd 0.8 x 0.3: 1 -1.55,0.75; 2 -1.55,0.25; 3 -1.55,-0.25; 4 -1.55,-0.75; 9 1.55,-0.75; 10 1.55,-0.25; 11 1.55,0.25; 12 1.55,0.75 | smd 0.3 x 0.8: 5 -0.75,-1.55; 6 -0.25,-1.55; 7 0.25,-1.55; 8 0.75,-1.55; 13 0.75,1.55; 14 0.25,1.55; 15 -0.25,1.55; 16 -0.75,1.55 | smd 1.7 x 1.7: 17 0,0
B3440_3MM-X-3MM = smd 0.65 x 1.55: 1 -1.2,-0.75 | smd 0.65 x 0.8: 2 0,-1.125; 3 1.2,-1.125; 4 1.2,1.125; 5 0,1.125; 6 -1.2,1.125
S-PDSO-G10 = smd 0.3 x 1.45: 1 -1,-2.2; 2 -0.5,-2.2; 3 0,-2.2; 4 0.5,-2.2; 5 1,-2.2; 6 1,2.2; 7 0.5,2.2; 8 0,2.2; 9 -0.5,2.2; 10 -1,2.2
TTE_EN11-HSM = drill 1 pad 1.75 octagon: A -2.5,-7.5 | drill 1 pad 1.75: B 2.5,-7.5; C 0,-7.5; D -2.5,7; E 2.5,7 | smd 2.6 x 3.4: GND11 -4.65,0; GND12 4.65,0 | smd 2.6 x 3.4 bottom: GND21 -4.65,0; GND22 4.65,0 | hole 2.8: 0,0
SMA_UFL_PAD_TINY = smd 1.524 x 1.016: ANT1 -3.843,0 | drill 0.559 pad 1.27: ANT2 -5.08,0 | smd 2.032 x 1.143 bottom: ANT3 -3.589,0 | smd 2.2 x 1.016: GND1 -2.223,1.47; GND2 -2.223,-1.47 | smd 4.318 x 1.524: GND3 -2.349,-2.54; GND4 -2.349,2.54 | smd 4.318 x 1.524 bottom: GND5 -2.349,2.54; GND6 -2.349,-2.54
USB-B-MICRO-SMD_MOLEX-105017-0001 = smd 0.35 x 1.8: D+ 0,4.4; D- -0.65,4.4; GND 1.3,4.4; ID 0.65,4.4; VBUS -1.3,4.4 | drill 0.85 pad 1.45: JSHIELD -2.5,4.15; JSHIELD@2 2.5,4.15 | drill 1 pad 1.8 octagon: JSHIELD@3 -3.5,1.45; JSHIELD@6 3.5,1.45 | drill 0.85 square: JSHIELD@4 -1,1.45; JSHIELD@5 1,1.45
PHOENIX_1990067_1X8X2MM50_PTSA-0-5 = drill 1 pad 1.93 square: 1 -7.5,5 | drill 1 pad 1.93 octagon: 2 -5,0; 3 -2.5,5; 4 0,0; 5 2.5,5; 6 5,0; 7 7.5,5; 8 10,0

### Placement (x,y rotation side)
C101  45.72,72.39 180 bottom
C221  21.59,15.24 90 bottom
C222  21.59,17.78 270 bottom
C311  6.35,25.4 270 top
C312  6.35,34.29 180 top
C321  8.89,36.83 270 top
C401  19.05,26.67 0 top
C403  20,34.29 0 top
C404  12.7,45.72 180 bottom
C406  24.13,36.83 180 top
C407  12.7,43.18 0 top
C408  24.13,44.45 270 top
C411  8.89,42.55 0 top
C412  12.7,40.64 0 top
C413  10.79,36.83 270 top
C511  20,54.61 90 top
C521  17.78,50.8 270 top
C531  19.05,58.42 270 top
C532  16.51,58.42 270 top
C551  13.97,62.23 180 top
C552  13.97,64.77 180 top
C553  20.95,65.09 90 top
C591  17.78,77.47 180 top
C593  17.78,82.55 180 top
C595  26.67,77.47 180 top
C597  26.67,82.55 180 top
C601  31.75,77.47 0 bottom
C621  31.75,82.55 0 bottom
C711  39.37,85.09 90 top
D141  58.42,30.48 0 top
FIDU_BL  [FIDUCIAL_MARK_1MM]  2.54,13.34 0 top
FIDU_BR  [FIDUCIAL_MARK_1MM]  67.31,2.54 0 top
FIDU_TL  [FIDUCIAL_MARK_1MM]  9.84,87 0 top
FIDU_TR  [FIDUCIAL_MARK_1MM]  68.42,87 0 top
H2311  5.08,5.08 0 top
H2321  73.03,5.08 0 top
H2331  5.08,84.45 0 top
H2341  73.03,84.45 0 top
L101  49.53,74.93 270 bottom
L102  41.91,74.93 270 bottom
L401  13.97,46.99 270 top
L402  20.64,30.48 90 top
L403  17.46,30.48 90 top
L404  10.16,46.99 270 top
L421  17.78,46.99 270 top
L422  20.64,47.31 270 bottom
L521  17.78,67.31 0 top
L592  19.05,80.01 90 top
L596  27.94,80.01 90 top
L611  34.77,79.53 270 top
PF711  49.53,80.01 90 top
R111  33.02,21.59 180 top
R112  33.02,24.13 180 top
R113  33.02,26.67 180 top
R114  26.67,41.91 180 top
R121  26.67,39.05 180 top
R131  48.26,62.23 180 bottom
R141  55.88,34.29 180 top
R142  55.88,36.83 180 top
R143  55.88,39.37 180 top
R151  50.8,29.21 180 bottom
R152  50.8,44.45 180 bottom
R211  10.16,26.67 0 top
R212  10.16,24.13 0 top
R321  7.62,36.83 90 top
R413  12.7,38.1 0 top
R521  50.8,49.53 180 bottom
R711  38.1,85.09 90 top
R721  59.69,13.97 0 top
R722  59.69,16.51 0 top
R723  59.69,19.05 0 top
R724  59.69,21.59 0 top
R733  59.69,64.77 0 top
R734  59.69,67.31 0 top
R735  59.69,69.85 0 top
R736  59.69,72.39 0 top
U101  45.72,43.18 90 top
U301  7.62,30.48 90 top
U401  19.05,40.64 270 top
U411  8.89,40.64 0 top
U511  17.78,54.61 180 top
U521  17.78,63.5 90 top
U581  17.78,71.12 0 top
U611  34.29,80.01 90 bottom
X221  16.51,16.51 90 top
X591  19.05,89.53 90 top
X595  27.94,89.53 90 top
X711  45.72,88.9 180 top
X721  71.12,19.05 90 top
X722  71.12,43.18 90 top
X723  71.12,67.31 90 top

### Tracks (layer width: path | path; a pad name or v marks a point on that pad's centre or on a via)
26MHZ_DAC_OUT
  Top 0.152: U301.6 7.94,32.64 7.94,31.75 8.26,31.43 8.89,31.43 9.21,31.75 9.21,34.29 7.62,35.88 R321.1
+3V3  (via drill 0.3)
  Top 0.15: 34.61,81.76 arc45 34.69,81.56 L611.1 | C511.1 20.15,53.82 v20.8,53.82
  Top 0.152: L403.1 18.4,28.12 C401.1 18.4,26.05 v18.41,25.88 | R211.2 10.79,26.66 v10.79,25.4 10.79,24.14 R212.2 | v5.4,26.04 6.33,26.04 C311.1 6.64,26.34 U301.1 | U301.7 7.3,32.64 7.3,33.97 7,34.27 C312.1 7,34.62 | U301.5 8.57,32.65 8.57,34.29 8.26,34.61 7.3,34.61 7,34.62 | 7,34.62 6.7,34.92 v6.67,34.92 | v8.26,43.18 8.26,42.56 C411.1 8.24,41.49 U411.4 | L404.1 v10.16,49.53 | U511.6 19.65,53.61 C511.1 | U521.13 15.14,64.25 C552.1 | U521.15 14.99,63.25 14.61,62.87 14.61,62.24 C551.1 | U521.7 20.57,63.75 20.95,64.14 C553.1 20.97,64.45 v21.75,64.45
  Top 0.3: v14.61,65.56 14.61,64.78 C552.1 | v14.61,61.44 14.61,62.22 C551.1 | 34.61,81.76 35.08,82.23 36.04,82.23 36.2,82.39 v36.2,82.71
  Top 0.406: 34.61,81.76 34.45,81.76 v33.5,82.71
  Bottom 0.15: 32.54,82.55 C621.1
  Bottom 0.3: U611.5 32.6,81.52 C621.1
  Bottom 0.406: v33.5,82.71 32.7,82.71 32.54,82.55
  pour Route15 (isolate 0.305, rank 2): 74.97,0.64 3.13,0.64 arc-90 0.64,3.13 0.64,86.4 arc-90 3.13,88.9 74.97,88.9 arc-90 77.47,86.4 77.47,3.13 arc-90
+5V  (via drill 0.3)
  Top 0.3: PF711.1 v49.53,77.47 63.34,77.47 66,74.81 X723.7
  Bottom 0.15: 32.7,77.47 C601.1
  Bottom 0.3: L101.1 v49.53,77.47 | U611.8 38.1,80.01
  Bottom 0.406: 38.1,80.01 38.73,80.01 | 38.73,80.01 44.45,80.01 46.99,77.47 v49.53,77.47 | U611.1 32.6,78.5 C601.1 | 38.73,80.01 38.73,76.83 38.1,76.2 33.34,76.2 32.7,76.83 32.7,77.47
ANT09  (via drill 0.3)
  Top 0.3: C593.1 18.43,81.48 L592.2 | 18.41,82.56 18.41,83.19 19.05,83.82 X591.ANT2 X591.ANT1 v19.05,86.68
  Top 0.406: 18.41,82.56 C593.1
  Bottom 0.3: X591.ANT3 v19.05,86.68
ANT09_MATCH
  Top 0.3: C591.1 18.43,78.54 L592.1 | U581.5 17.78,74.3 18.41,74.93 18.41,77.45
  Top 0.406: 18.41,77.45 C591.1
ANT24
  Top 0.3: L596.2 27.32,81.48 C597.1 27.32,83.2 27.94,83.82 X595.ANT2 X595.ANT1
  Bottom 0.3: X595.ANT3 X595.ANT2
FE09_ANT
  Top 0.3: U521.9 18.53,67.21 | L521.2 18.63,68.05 17.78,68.9 U581.2
  Top 0.406: 18.53,67.21 L521.2
FE09_DET  (via drill 0.3)
  Top 0.152: v49.53,49.53 46.99,49.53 40.64,43.18 30.48,43.18 26.67,46.99 24.13,46.99 22.86,45.72 21.59,46.99 21.59,62.23 21.07,62.75 U521.5
  Bottom 0.152: R521.1 v49.53,49.53
FE09_IND
  Top 0.152: U521.10 18.03,65.79 16.93,66.89 L521.1
FE09_MODE  (via drill 0.3)
  Top 0.152: U101.23 52.07,71.12 v29.69,71.12 | v22.54,71.12 v20,68.58 | U521.16 16.19,62.71 v16.19,61.91
  Bottom 0.152: v29.69,71.12 v22.54,71.12 | v16.19,61.91 16.19,64.77 v20,68.58
FE09_RX
  Top 0.3: C532.1 14.27,59.07 12.38,60.96 12.38,63.18 12.95,63.75 U521.14
FE09_TX
  Top 0.3: U521.3 18.03,61.34 19.05,60.33 C531.1
FPGA_1_34_N
  Top 0.3: U101.30 36.6,59.69 34.29,62.01 32.93,62.01 31.52,63.41 31.52,64.86 32.93,66.27 43.27,66.27 48.35,61.19 57.06,61.19 58.33,62.45 70.97,62.45 X723.2
FPGA_1_34_P
  Top 0.3: U101.28 36.6,64.77 34.29,62.45 33.11,62.45 31.98,63.59 31.98,64.68 33.11,65.81 43.09,65.81 48.17,60.73 57.24,60.73 58.51,62.01 67.38,62.01 67.94,61.44 67.94,60.8 67.15,60.01 66.32,60.01 X723.1
FPGA_3_34_N
  Top 0.3: U101.29 40.41,59.91 43.27,59.91 49.62,53.56 70.73,53.56 X722.8
FPGA_3_34_P
  Top 0.3: U101.31 40.41,59.47 43.09,59.47 49.44,53.12 64.77,53.12 66.12,51.77 X722.7
FPGA_3P35
  Top 0.152: U101.6 51.44,26.67 50.96,26.19 50.96,23.18 51.28,22.86 55.88,22.86 57.15,21.59 R724.1
FPGA_3P35_R
  Top 0.152: 60.38,21.55 X721.5
  Top 0.3: R724.2 60.38,21.55
FPGA_5_34_N
  Bottom 0.3: U101.32 38.33,54.61 39.37,53.56 43.27,53.56 48.35,48.48 70.81,48.48 X722.6
FPGA_5_34_P
  Bottom 0.3: U101.33 38.33,52.07 39.37,53.12 43.09,53.12 48.17,48.03 64.77,48.03 66.12,46.69 X722.5
FPGA_5_35_N
  Bottom 0.3: U101.14 55.66,44.67 63.59,44.67 64.86,43.41 70.89,43.41 arc-90 X722.4
FPGA_5_35_P
  Bottom 0.3: U101.12 55.66,44.23 63.41,44.23 64.68,42.95 64.77,42.95 66.04,40.76 arc90 X722.3
FPGA_7N35
  Top 0.152: U101.4 54.61,21.59 57.15,19.05 R723.1
FPGA_7N35_R
  Top 0.152: R723.2 X721.4
FPGA_9N35  (via drill 0.3)
  Top 0.152: v58.42,67.31 R734.1
  Bottom 0.152: U101.17 54.61,54.61 55.88,55.88 55.88,64.77 v58.42,67.31
FPGA_9N35_R
  Top 0.152: R734.2 X723.4
FPGA_10P35
  Top 0.152: U101.22 54.61,67.31 55.88,68.58 55.88,71.12 57.15,72.39 R736.1
FPGA_10P35_R
  Top 0.152: R736.2 71.04,72.39
  Top 0.3: 71.04,72.39 X723.6
FPGA_11_16_N
  Bottom 0.3: U101.8 55.66,29.43 67.4,29.43 68.9,27.94 69.85,27.94 70.96,29.05 X721.8
FPGA_11_16_P
  Bottom 0.3: U101.5 58.2,28.98 67.22,28.98 68.58,27.62 68.58,26.67 68.46,26.55 X721.7
FPGA_12P16
  Top 0.152: U101.3 54.61,19.05 55.88,17.78 55.88,15.24 57.15,13.97 R721.1
FPGA_12P16_R
  Top 0.152: 60.42,14.05 X721.2
  Top 0.3: R721.2 60.42,14.05
FPGA_12P34
  Top 0.152: U101.36 35.56,44.45 27.94,52.07 27.94,67.31 29.21,68.58 44.45,68.58 46.99,66.04 54.61,66.04 58.42,69.85 R735.1
FPGA_12P34_R
  Top 0.152: R735.2 66.08,69.85
  Top 0.3: 66.08,69.85 X723.5
FPGA_13P_34
  Top 0.152: U101.46 44.45,19.05 45.72,20.32 54.61,20.32 58.42,16.51 R722.1
FPGA_13P_34_R
  Top 0.152: 60.38,16.55 X721.3
  Top 0.3: R722.2 60.38,16.55
FPGA_16_34_N
  Bottom 0.3: U101.39 39.15,35.78 62.23,35.78 64.62,38.18 X722.2
FPGA_16_34_P
  Bottom 0.3: U101.41 41.69,35.34 65.78,35.34 X722.1
FPGA_AD12  (via drill 0.3)
  Top 0.152: v58.42,64.77 R733.1
  Bottom 0.152: U101.16 54.61,52.07 57.15,54.61 57.15,63.5 v58.42,64.77
FPGA_AD12_R
  Top 0.152: R733.2 66.08,64.77 X723.3
FPGA_FE09_DET
  Bottom 0.15: R521.2 U101.15
FPGA_I2C_SCL  (via drill 0.3)
  Top 0.152: R212.1 8.89,24.13 7.95,25.07 U301.3 7.94,28.34 7.94,29.53 7.62,29.84 4.13,29.84 3.49,30.48 3.49,68.58 5.4,70.48 v6.35,70.48
  Bottom 0.152: U101.26 36.2,69.85 35.56,70.48 v6.35,70.48
FPGA_I2C_SDA  (via drill 0.3)
  Top 0.152: R211.1 8.6,27.59 U301.4 8.57,28.35 8.57,30.16 8.26,30.48 4.45,30.48 4.13,30.8 4.13,67.94 5.71,69.53 v6.35,69.53
  Bottom 0.152: U101.27 35.56,67.31 33.34,69.53 v6.35,69.53
FPGA_MISO  (via drill 0.3)
  Top 0.152: R114.1 33.97,41.91 34.29,41.59 v34.29,38.1
  Bottom 0.152: U101.42 34.61,29.21 34.29,29.53 v34.29,38.1
FPGA_MOSI
  Top 0.152: U101.43 R113.1
FPGA_SCLK
  Top 0.152: U101.45 R111.1
FPGA_SELN
  Top 0.152: U101.44 R112.1
FPGA_TRX_CLKO  (via drill 0.3)
  Top 0.152: R413.1 11.75,38.1 | 11.13,37.48 C413.1
  Top 0.3: 11.75,38.1 11.59,37.94 | 11.59,37.94 11.13,37.48 | v10.79,38.73 11.59,37.94
  Bottom 0.3: v10.79,38.73 5.87,43.66 5.87,68.1 3.81,70.17 3.81,71.91 5.56,73.66 33.81,73.66 36.35,71.12 44.61,71.12 45.88,69.85 45.88,65.88 46.99,64.77 U101.21
FPGA_TRX_IRQ
  Top 0.152: R121.1 27.94,39.05 32.7,34.29 U101.40
FPGA_TRX_RSTN
  Bottom 0.152: R131.2 U101.20
GND  (via drill 0.3)
  Top 0.152: X711.GND 44.42,83.79 43.18,82.55 41.26,82.55 C711.1 R711.1 | L402.1 19.7,28.12 C401.2 19.7,26.05 v19.68,25.88 | v5.4,24.77 6.33,24.77 C311.2 6.37,24.77 6.99,24.77 7.29,25.07 U301.2 | U301.8 6.64,33.04 5.7,33.99 C312.2 5.4,34.59 v5.4,34.92 | C321.2 C413.2 10.78,36.2 v9.84,36.2 | v9.53,43.18 9.53,42.56 C411.2 9.54,42.24 8.89,41.59 8.89,40.32 9.21,40.01 9.76,40.01 U411.2 | L401.1 v13.97,49.53 | U511.2 17.78,54.93 18.1,54.61 19.05,54.61 19.7,55.26 | U581.4 19.05,72.17 v20,71.12 19.05,70.06 U581.3 | U581.6 16.51,72.17 v15.56,71.44 15.63,71.37 U581.1 | U521.8 19.8,64.25 20,64.45 20,65.41 20.32,65.72 20.94,65.72 C553.2 21.57,65.74 v21.75,65.72 | U521.4 18.53,61.8 19.05,61.28 v19.37,61.28 | v17.14,77.47 C591.2 | v17.14,82.55 C593.2 | D141.1 D141.2 D141.3 56.72,29.1 v56.36,28.73
  Top 0.3: L421.1 17.38,48.49 v17.46,48.58 | 19.7,55.26 C511.2 | v13.34,65.56 13.34,64.78 C552.2 | v13.34,61.44 13.34,62.22 C551.2 | v16.19,88.9 16.19,87.5 X591.GND4 17.45,87.19 X591.GND1 | v16.51,87 16.19,86.68 v16.19,85.41 | v21.91,88.9 21.91,87.5 X591.GND3 20.65,87.19 X591.GND2 | v21.91,85.41 21.59,85.72 v21.59,87 | 44.42,83.79 44.45,83.76 v44.45,83.19 | X595.GND4 25.4,88.58 v25.08,88.9 | v25.08,85.41 25.4,85.72 v25.4,87 X595.GND4 | v30.8,85.41 30.8,86.68 v30.48,87 X595.GND3 | v30.8,88.9 30.8,87.5 X595.GND3 | X595.GND1 25.53,87.31 X595.GND4 | X595.GND2 30.35,87.31 X595.GND3
  Bottom 0.15: 31.43,80.01 U611.3
  Bottom 0.152: 41.91,76.52 v41.91,77.47 | C221.2 21.59,16.51 | 21.59,16.51 C222.2 | X221.C 21.59,16.51
  Bottom 0.3: v22.54,47.31 L422.2 L422.5 | C601.2 30.48,77.89 30.48,79.53 | 30.48,79.53 30.48,80.01 | 30.48,80.01 30.48,80.49 30.5,80.51 | 30.48,80.01 31.43,80.01 | 30.48,79.53 31.43,79.53 | U611.6 36.7,80.8 v37.78,80.8 | U611.10 36.44,79.06 35.4,79.06 35.24,79.22 35.24,80.49 35.56,80.8 35.88,80.8 36.08,81.01 U611.6 | U611.7 U611.6
  Bottom 0.406: v30,82.39 30.16,82.55 30.96,82.55 | v30,77.63 30.32,77.31 30.8,77.31
  other vias: 17.78,63.5 26.04,82.55 26.04,77.47 29.21,26.67 33.66,64.14 43.34,83.19
  pour Top (isolate 0.305): 74.97,0.64 3.13,0.64 arc-90 0.64,3.13 0.64,86.4 arc-90 3.13,88.9 74.97,88.9 arc-90 77.47,86.4 77.47,3.13 arc-90
  pour Route2 (isolate 0.305, rank 2): 74.97,0.64 3.13,0.64 arc-90 0.64,3.13 0.64,86.4 arc-90 3.13,88.9 74.97,88.9 arc-90 77.47,86.4 77.47,3.13 arc-90
  pour Bottom (isolate 0.305): 74.97,0.64 3.13,0.64 arc-90 0.64,3.13 0.64,86.4 arc-90 3.13,88.9 74.97,88.9 arc-90 77.47,86.4 77.47,3.13 arc-90
LED_B
  Top 0.152: D141.6 59.27,31.38 58.9,31.75 58.9,37 R143.1
LED_B_R
  Top 0.152: U101.11 R143.2
LED_G
  Top 0.152: D141.5 58.74,30.48 58.42,30.8 58.42,34.94 R142.1
LED_G_R
  Top 0.152: U101.10 R142.2
LED_R
  Top 0.152: D141.4 58.21,29.58 57.94,29.84 57.94,32.88 R141.1
LED_R_R
  Top 0.152: U101.9 R141.2
PE09_RF1
  Top 0.3: U511.1 18.46,55.61 19.05,56.2 C531.2
PE09_RF2
  Top 0.3: C532.2 16.51,56.23 U511.3
PE09_RFC
  Top 0.3: U511.5 C521.1
PMIC3V3_SW  (via drill 0.3)
  Top 0.3: L611.2 35.29,78.11 v36.83,78.11
  Bottom 0.3: U611.9 36.51,79.53 37.31,79.53 37.78,79.06 37.78,78.58 37.31,78.11 v36.83,78.11
ROT_I
  Bottom 0.152: U101.7 R151.2
ROT_I_R  (via drill 0.3)
  Top 0.152: X221.A 24.05,13.97 31.75,13.97 34.29,16.51 v34.29,19.05
  Bottom 0.152: C221.1 22.17,14.01 X221.A | v34.29,19.05 35.56,20.32 41.91,20.32 44.45,22.86 44.45,27.94 45.72,29.21 R151.1
ROT_Q
  Bottom 0.152: U101.13 R152.2
ROT_Q_R  (via drill 0.3)
  Top 0.152: X221.B 25.32,20.32 39.37,20.32 41.91,22.86 41.91,40.64 45.72,44.45 v49.53,44.45
  Bottom 0.152: C222.1 22.17,19.01 X221.B | v49.53,44.45 R152.1
TRX_AVDD0
  Top 0.152: U401.14 13.64,42.89 C407.2
TRX_AVDD1
  Top 0.152: C408.2 23.22,42.89 U401.47
TRX_AVSS  (via drill 0.3)
  Top 0.15: U401.6 U401.7 18.73,44.21 18.73,45.4 v19.05,45.72
  Top 0.152: U401.48 22.55,43.52 C408.1 24.46,45.1 v24.92,45.09 | U401.3 20.8,44.61 21.27,45.09 v21.27,45.4 | v21.59,38.1 v18.73,38.42 19.05,38.42 v19.05,40.01 U401.49 19.05,41.59 v17.78,42.86 20.64,42.86 v21.27,42.23 | U401.10 17.3,44.92 v17.46,45.09 | v13.97,45.72 L401.2 13.34,44.93 13.34,44.77 12.05,43.48 C407.1 | U401.45 23.48,41.89 v23.5,41.91 | U401.16 14.62,41.89 v14.61,41.91 | U401.18 15.46,40.8 v14.61,40.8 15.14,40.8 U401.19
  Bottom 0.152: C404.2 13.35,45.7 v13.97,45.72
  pour Route2 (isolate 0.305): 11.43,46.99 25.4,46.99 25.4,36.83 11.43,36.83
TRX_CLKO
  Top 0.152: U401.22 14.14,38.89 R413.2
TRX_DEVDD  (via drill 0.3)
  Top 0.152: U401.29 18.3,35.67 19.05,34.92 v19.05,34.29 | v19.05,34.29 C403.1 | v19.05,34.29 19.05,33.02 17.93,31.9 L403.2 17.31,31.75 16.19,31.75 12.7,35.24 12.7,39.05 13.04,39.39 U401.21 | U401.39 23.66,38.89 v23.81,38.73
  Bottom 0.152: v23.81,38.73 23.81,38.42 19.68,34.29 v19.05,34.29
TRX_DVDD
  Top 0.152: U401.37 23.48,36.96 C406.2
TRX_DVSS  (via drill 0.3)
  Top 0.152: C403.2 v20.64,34.29 | U401.38 23.22,38.39 C406.1 v25.56,36.83 | v20.64,34.29 L402.2 | U401.32 19.8,36.4 20.64,35.24 v20.64,34.29 | U401.20 14.72,39.89 v14.61,40.01 | U401.23 v14.61,38.1 14.63,38.07 15.13,37.89 U401.24
  Bottom 0.152: v25.56,36.83 22.86,36.83 20.64,34.61 v20.64,34.29 20.64,33.97 19.68,33.02 15.88,33.02 14.61,34.29 v14.61,38.1 v14.61,40.01
TRX_EVDD  (via drill 0.3)
  Top 0.152: L404.2 11.28,45.57 v11.43,45.72 | U401.46 23.02,42.39 23.18,42.55 v24.13,42.55 | v13.34,42.23 13.65,42.23 13.97,42.55 14.92,42.55 15.08,42.39 U401.15
  Bottom 0.152: C404.1 v11.43,45.72
  pour Route15 (isolate 0.305): 10.16,46.99 25.4,46.99 25.4,41.27 10.16,41.27
TRX_FEA09
  Top 0.152: U401.11 16.8,52.04 17.13,52.37 U511.4 17.13,54.31 15.56,55.88 15.56,58.1 15.88,58.42 17.14,58.42 17.53,58.8 U521.2
TRX_FEB09  (via drill 0.3)
  Top 0.152: U401.12 16.3,51.96 14.61,53.66 v14.61,57.47 | U521.1 17.03,61.16 v16.19,60.33
  Bottom 0.152: v16.19,60.33 14.61,58.74 v14.61,57.47
TRX_IRQ
  Top 0.152: U401.40 22.57,39.37 25.72,39.37 R121.2
TRX_MISO
  Top 0.152: R114.2 25.5,41.39 U401.44
TRX_MOSI  (via drill 0.3)
  Top 0.152: U401.43 32.13,40.89 32.38,40.64 v32.38,38.1 | R113.2 32.37,31.73 v32.38,31.75
  Bottom 0.152: v32.38,38.1 v32.38,31.75
TRX_RF09
  Top 0.152: L421.4 18.18,48.02
  Top 0.3: 18.18,48.02 18.41,48.26 18.41,49.52 C521.2
TRX_RF09_N
  Top 0.152: L421.2 18.03,45.34 18.03,44.77 17.8,44.38 U401.9
TRX_RF09_P
  Top 0.152: L421.3 18.32,46.13 18.32,44.77 18.3,44.43
  Top 0.3: 18.3,44.43 U401.8
TRX_RF24  (via drill 0.3)
  Top 0.3: L596.1 27.32,78.54 C595.1 27.3,77.45 27.3,73.34 25.24,71.28 25.24,50.96 v22.86,48.58
  Bottom 0.3: L422.1 22.24,47.96 v22.86,48.58
TRX_RF24_N  (via drill 0.3)
  Top 0.3: v19.63,45.09 19.78,45.09 19.78,44.77 19.8,44.74 U401.5
  Bottom 0.3: L422.4 19.78,46.62 19.78,45.09 v19.63,45.09
TRX_RF24_P  (via drill 0.3)
  Top 0.3: v20.38,45.09 20.23,45.09 20.3,45.01 U401.4
  Bottom 0.3: L422.3 20.23,45.35 20.23,45.09 v20.38,45.09
TRX_RSTN  (via drill 0.3)
  Top 0.152: U401.13 15.55,51.44 10.16,56.83 v10.16,60.48
  Bottom 0.152: v10.16,60.48 15.08,60.48 15.56,60.96 18.1,60.96 18.41,60.64 20.64,60.64 20.95,60.96 45.72,60.96 46.99,62.23 R131.1
TRX_RXCLK_N  (via drill 0.3)
  Top 0.152: U401.33 20.3,36.21 21.36,35.15 21.36,33.88 21.75,33.5
  Top 0.3: 21.75,33.5 v21.64,33.39
  Bottom 0.3: v21.64,33.39 21.75,33.5 27.71,27.53 27.71,20.23 32.93,15.02 37.05,15.02 U101.48
TRX_RXCLK_P  (via drill 0.3)
  Top 0.152: U401.34 20.8,36.35 21.82,35.34 21.82,34.07 22.07,33.81
  Top 0.3: 22.07,33.81 v22.17,33.92
  Bottom 0.3: v22.17,33.92 22.07,33.81 28.16,27.72 28.16,20.41 33.11,15.46 37.05,15.46 U101.47
TRX_RXD09_N  (via drill 0.3)
  Top 0.152: U401.30 18.8,36.44 18.89,36.04 18.89,35.98
  Top 0.3: 19.14,35.88 v18.99,35.88 18.89,35.98
  Bottom 0.3: U101.37 37.88,41.91 36.83,40.87 22.13,40.87 19.14,37.88 19.14,35.88 v18.99,35.88
TRX_RXD09_P  (via drill 0.3)
  Top 0.152: U401.31 19.3,36.58 19.74,35.82 v19.74,35.56
  Top 0.3: 19.59,35.56 v19.74,35.56
  Bottom 0.3: U101.38 37.88,39.37 36.83,40.41 22.32,40.41 19.59,37.69 19.59,35.56 v19.74,35.56
TRX_RXD24_N  (via drill 0.3)
  Top 0.152: U401.35 21.3,36.48 22.7,35.4
  Top 0.3: 22.7,35.4 v22.59,35.3
  Bottom 0.3: v22.59,35.3 22.7,35.4 31.52,26.58 31.52,18.96 32.93,17.55 44.36,17.55 46.9,15.02 52.3,15.02 U101.1
TRX_RXD24_P  (via drill 0.3)
  Top 0.152: U401.36 21.8,36.62 23.02,35.72
  Top 0.3: 23.02,35.72 v23.12,35.83
  Bottom 0.3: v23.12,35.83 23.02,35.72 31.98,26.76 31.98,19.14 33.11,18 44.54,18 47.08,15.46 52.3,15.46 U101.2
TRX_SCLK
  Top 0.152: U401.41 26.47,39.89 26.67,39.69 26.67,21.91 26.99,21.59 R111.2
TRX_SELN  (via drill 0.3)
  Top 0.152: U401.42 30.09,40.39 30.48,40.01 v30.48,38.1 | v30.48,31.75 30.48,24.45 30.8,24.13 R112.2
  Bottom 0.152: v30.48,38.1 v30.48,31.75
TRX_TCXO
  Top 0.152: U401.17 14.1,41.39 C412.2
TRX_TXCLK_N  (via drill 0.3)
  Top 0.152: 16.29,34.29 16.29,37.12 U401.25
  Top 0.3: 16.29,34.29 v16.14,34.29
  Bottom 0.3: U101.19 53.12,59.69 52.07,58.65 17.69,58.65 16.29,57.24 16.29,34.29 v16.14,34.29
TRX_TXCLK_P  (via drill 0.3)
  Top 0.152: 16.73,34.29 16.73,37.08 U401.26
  Top 0.3: 16.73,34.29 v16.89,34.29
  Bottom 0.3: U101.18 53.12,57.15 52.07,58.2 17.87,58.2 16.73,57.06 16.73,34.29 v16.89,34.29
TRX_TXD_N  (via drill 0.3)
  Top 0.152: U401.27 17.3,35.09 17.55,34.83 17.55,33.66
  Top 0.3: 17.55,33.66 v17.41,33.66
  Bottom 0.3: U101.34 37.88,49.53 36.83,48.48 25.31,48.48 17.55,40.73 17.55,33.66 v17.41,33.66
TRX_TXD_P  (via drill 0.3)
  Top 0.152: U401.28 17.8,35.22 18,35.02 18,33.66
  Top 0.3: 18,33.66 v18.16,33.66
  Bottom 0.3: U101.35 37.88,46.99 36.83,48.03 25.49,48.03 18,40.55 18,33.66 v18.16,33.66
USB_SHIELD
  Top 0.152: R711.2 C711.2 40.51,85.74 41.52,86.75 | 41.52,86.75 X711.JSHIELD@6 X711.JSHIELD@5 X711.JSHIELD@4 X711.JSHIELD@3 49.53,87.14 49.53,86.36 48.22,85.05 X711.JSHIELD | X711.JSHIELD@2 43.22,85.05 41.52,86.75
USB_VBUS
  Top 0.152: X711.VBUS 46.99,84.47
  Top 0.3: 46.99,84.47 46.99,82.55 48.13,81.41 PF711.2
VCCA
  Bottom 0.152: U101.24 50.65,72.39 L101.2 49.38,73.51 48.26,72.39 C101.2
VCTCXO_OUT
  Top 0.152: U411.3 9.82,41.27 10.48,41.27 11.11,40.64 C412.1
VCTCXO_VC
  Top 0.152: C321.1 R321.2 7.63,37.48 7.94,37.78 7.94,39.99 U411.1
VSSA
  Bottom 0.152: U101.25 40.79,72.39 L102.2 42.06,73.51 43.18,72.39 C101.1

### Text on the board
Top: TOP
Route2: L2
Route15: L3
Bottom: BOT
tPlace: ANT09 | ANT24 | POWER | UFBmod V1.0 / (C) 2019 / by DF4IAH
tNames: X591 | X595
tDocu: WDG20..WDG24